# EAGLE design Attenuverting_LinExp_VCA-alt2 (EAGLE 7.5.0)

## Sheet 1 of 5: Top Board
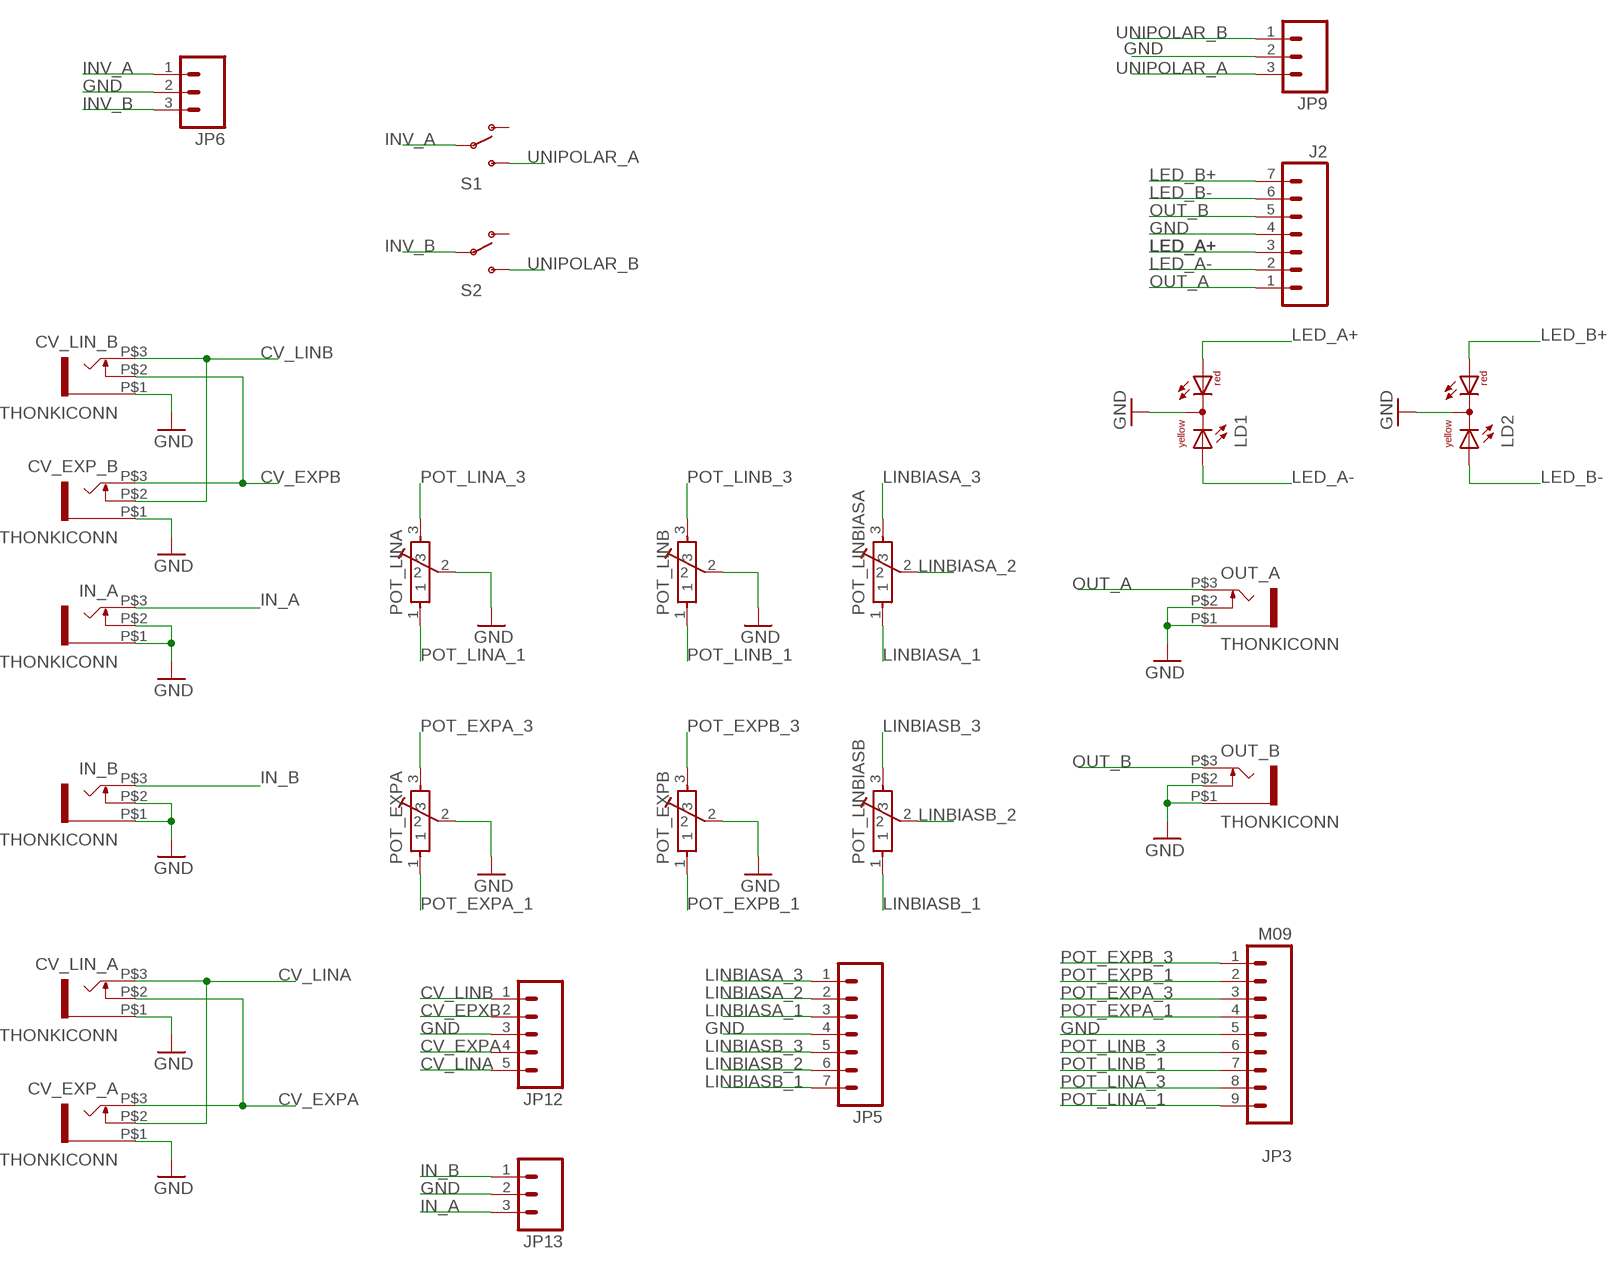
[diagram p0: schematic, sheet 1]

### Parts
CV_EXP_A  THONKICONN  [THONKICONN]
CV_EXP_B  THONKICONN  [THONKICONN]
CV_LIN_A  THONKICONN  [THONKICONN]
CV_LIN_B  THONKICONN  [THONKICONN]
IN_A  THONKICONN  [THONKICONN]
IN_B  THONKICONN  [THONKICONN]
J2  M07  [1X07]
JP3  M09  [1X09]
JP5  M07  [1X07]
JP6  M03PTH  [1X03]
JP9  M03PTH  [1X03]
JP12  M05PTH  [1X05]
JP13  M03PTH  [1X03]
LD1  DUOLED-RY-C  [DUOLED-C-5MM]
LD2  DUOLED-RY-C  [DUOLED-C-5MM]
OUT_A  THONKICONN  [THONKICONN]
OUT_B  THONKICONN  [THONKICONN]
POT_EXPA  POT-ALPS-RK09L1140  [POT-ALPS-RK09L1140]
POT_EXPB  POT-ALPS-RK09L1140  [POT-ALPS-RK09L1140]
POT_LINA  POT-ALPS-RK09L1140  [POT-ALPS-RK09L1140]
POT_LINB  POT-ALPS-RK09L1140  [POT-ALPS-RK09L1140]
POT_LINBIASA  POT-ALPS-RK09L1140  [POT-ALPS-RK09L1140]
POT_LINBIASB  POT-ALPS-RK09L1140  [POT-ALPS-RK09L1140]
S1  SWITCH-SPST  [SWITCH-SPDT-SALECOM-T8014]
S2  SWITCH-SPST  [SWITCH-SPDT-SALECOM-T8014]

### Nets
CV_EPXB: JP12.2
CV_EXPA: CV_EXP_A.P$3 CV_LIN_A.P$2 JP12.4 ; also sheet 3
CV_EXPB: CV_EXP_B.P$3 CV_LIN_B.P$2 ; also sheet 3
CV_LINA: CV_EXP_A.P$2 CV_LIN_A.P$3 JP12.5 ; also sheet 3
CV_LINB: CV_EXP_B.P$2 CV_LIN_B.P$3 JP12.1 ; also sheet 3
GND: CV_EXP_A.P$1 CV_EXP_B.P$1 CV_LIN_A.P$1 CV_LIN_B.P$1 IN_A.P$1 IN_A.P$2 IN_B.P$1 IN_B.P$2 J2.4 JP3.5 JP5.4 JP6.2 JP9.2 JP12.3 JP13.2 LD1.C LD2.C OUT_A.P$1 OUT_A.P$2 OUT_B.P$1 OUT_B.P$2 POT_EXPA.2 POT_EXPB.2 POT_LINA.2 POT_LINB.2 ; also sheet 2,3,4,5
IN_A: IN_A.P$3 JP13.3 ; also sheet 2
IN_B: IN_B.P$3 JP13.1 ; also sheet 2
INV_A: JP6.1 S1.2(P) ; also sheet 2
INV_B: JP6.3 S2.2(P) ; also sheet 2
LED_A+: J2.3 LD1.AR ; also sheet 2
LED_A-: J2.2 LD1.AX(AY) ; also sheet 2
LED_B+: J2.7 LD2.AR ; also sheet 2
LED_B-: J2.6 LD2.AX(AY) ; also sheet 2
LINBIASA_1: JP5.3 POT_LINBIASA.1 ; also sheet 3
LINBIASA_2: JP5.2 POT_LINBIASA.2 ; also sheet 3
LINBIASA_3: JP5.1 POT_LINBIASA.3 ; also sheet 3
LINBIASB_1: JP5.7 POT_LINBIASB.1 ; also sheet 3
LINBIASB_2: JP5.6 POT_LINBIASB.2 ; also sheet 3
LINBIASB_3: JP5.5 POT_LINBIASB.3 ; also sheet 3
OUT_A: J2.1 OUT_A.P$3 ; also sheet 2
OUT_B: J2.5 OUT_B.P$3 ; also sheet 2
POT_EXPA_1: JP3.4 POT_EXPA.1 ; also sheet 3
POT_EXPA_3: JP3.3 POT_EXPA.3 ; also sheet 3
POT_EXPB_1: JP3.2 POT_EXPB.1 ; also sheet 3
POT_EXPB_3: JP3.1 POT_EXPB.3 ; also sheet 3
POT_LINA_1: JP3.9 POT_LINA.1 ; also sheet 3
POT_LINA_3: JP3.8 POT_LINA.3 ; also sheet 3
POT_LINB_1: JP3.7 POT_LINB.1 ; also sheet 3
POT_LINB_3: JP3.6 POT_LINB.3 ; also sheet 3
UNIPOLAR_A: JP9.3 S1.3(S) ; also sheet 2
UNIPOLAR_B: JP9.1 S2.3(S) ; also sheet 2
Unconnected: POT_EXPA.P$5 POT_EXPA.P$6 POT_EXPB.P$5 POT_EXPB.P$6 POT_LINA.P$5 POT_LINA.P$6 POT_LINB.P$5 POT_LINB.P$6 POT_LINBIASA.P$5 POT_LINBIASA.P$6 POT_LINBIASB.P$5 POT_LINBIASB.P$6 S1.1(O) S2.1(O)

## Sheet 2 of 5: VCA Paths
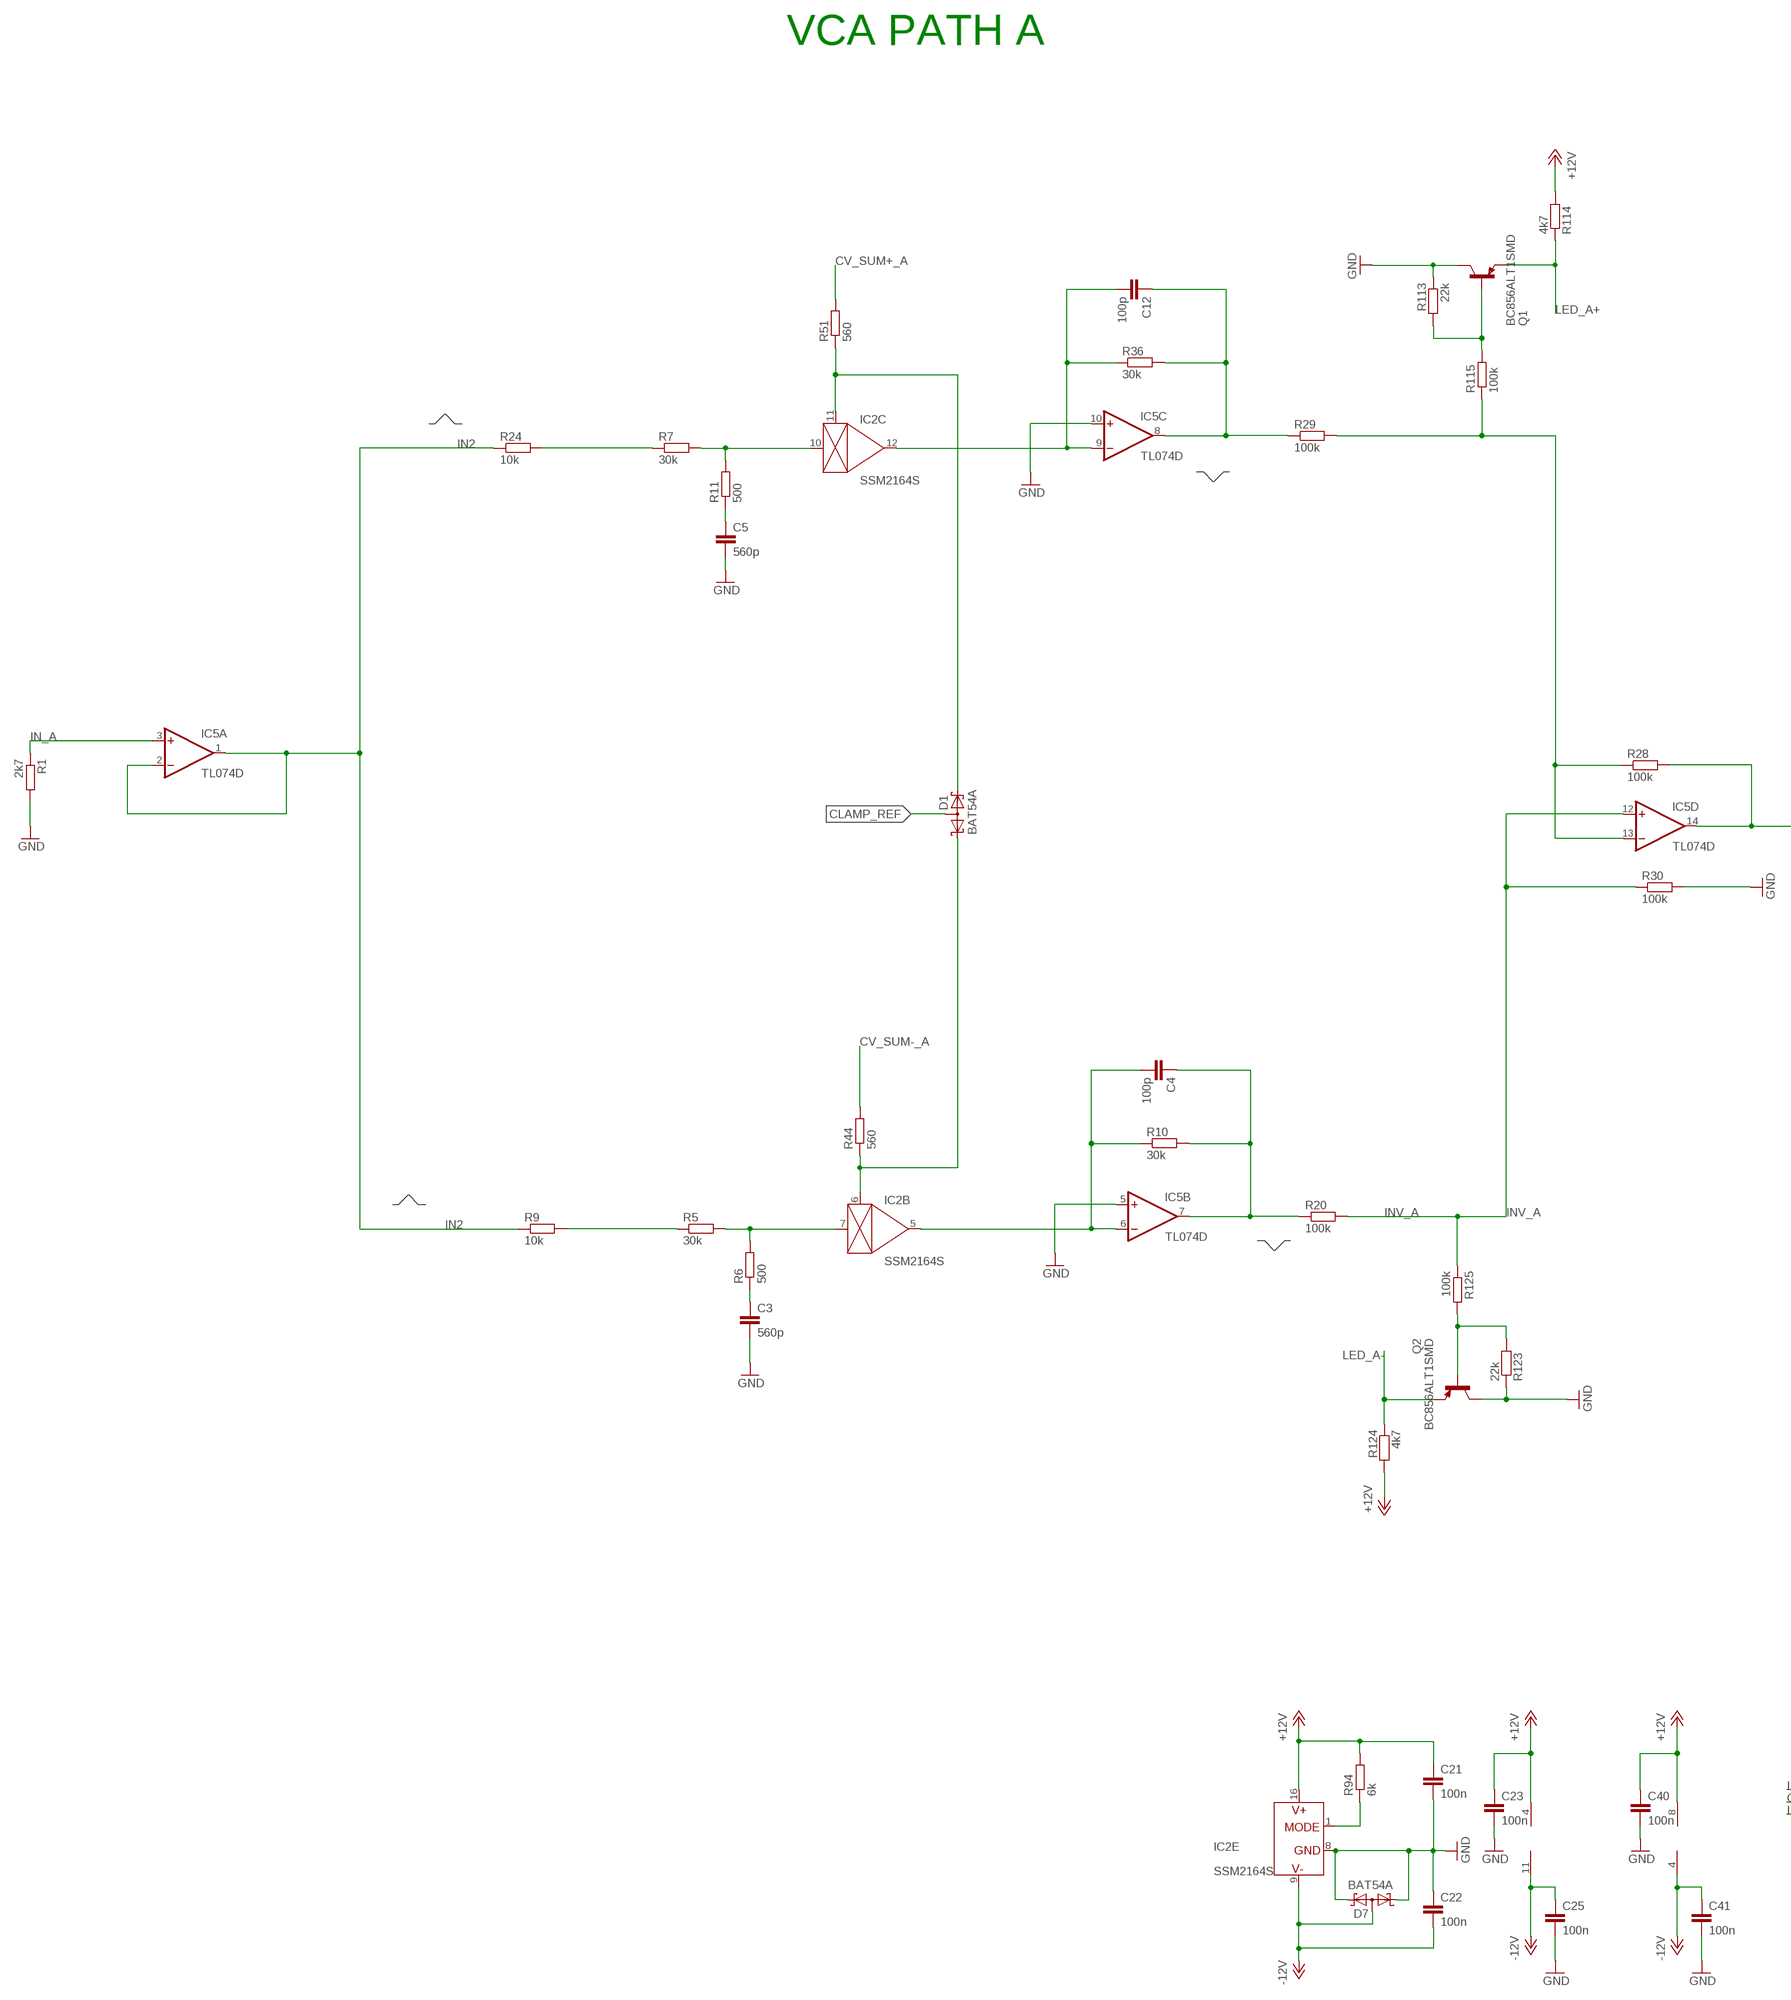
[diagram p1: schematic, sheet 2, part 1 of 2]
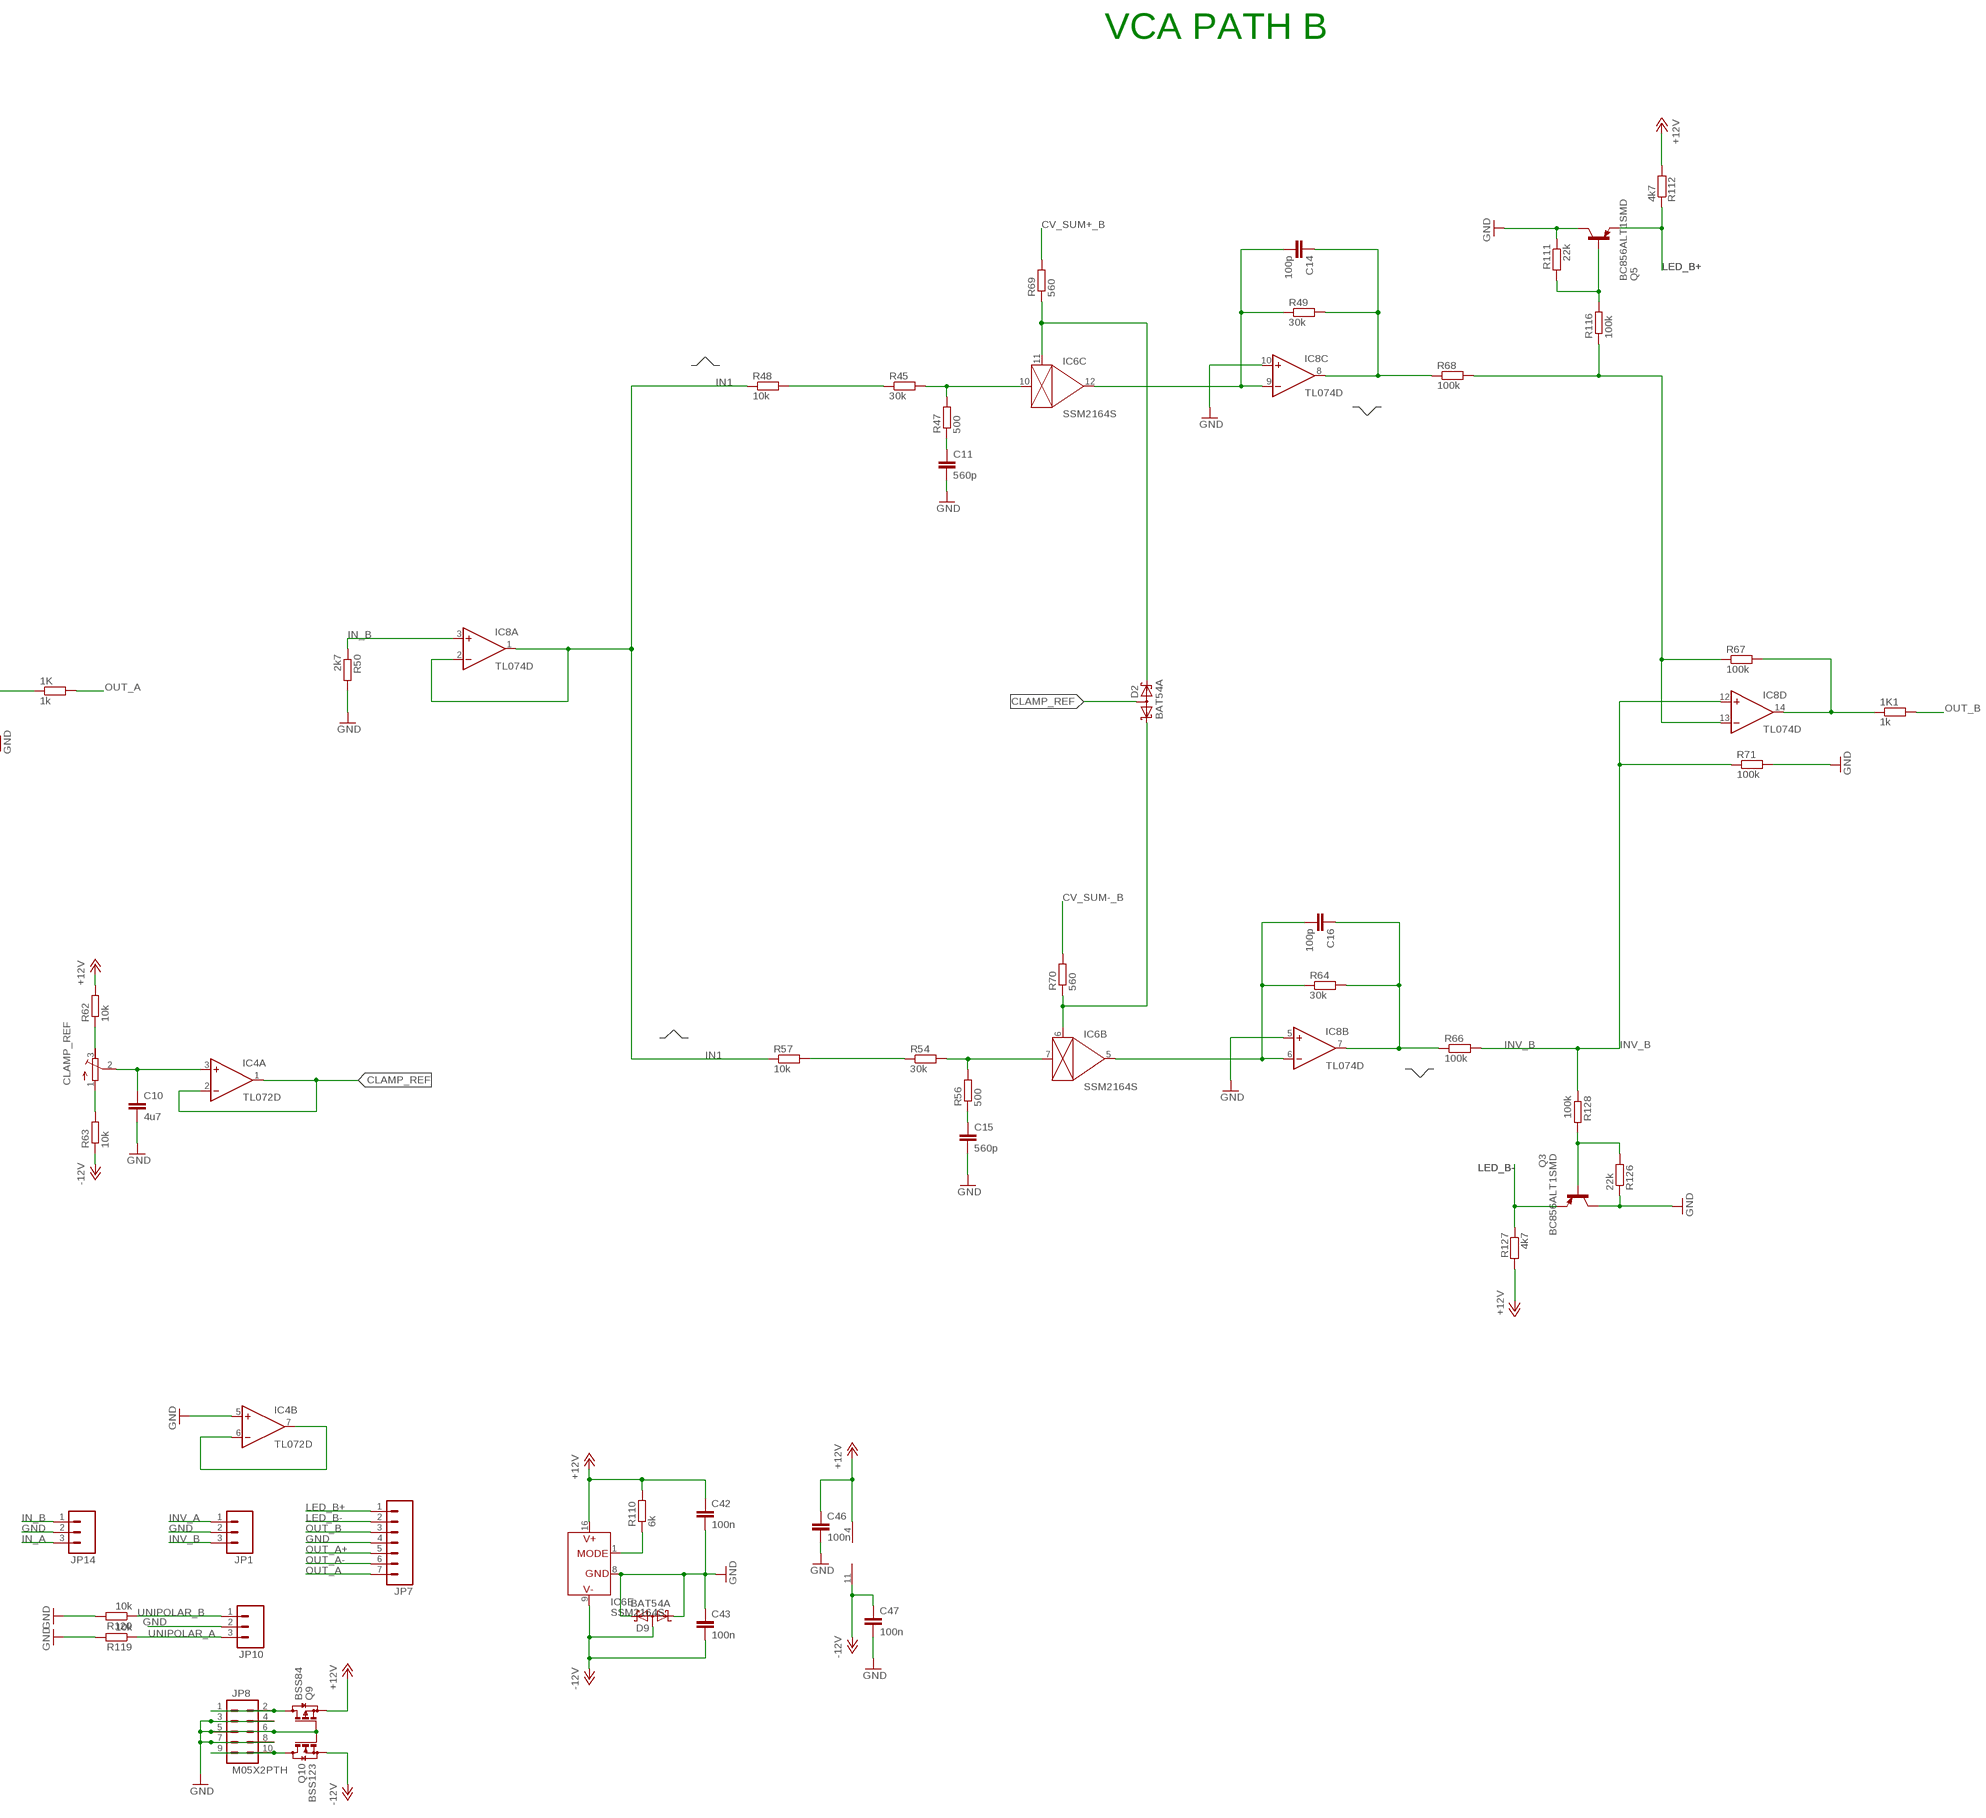
[diagram p2: schematic, sheet 2, part 2 of 2]

### Parts
1K  1k  R-EU_0603  [0603]
1K1  1k  R-EU_0603  [0603]
C3  560p  C-EUC0603K  [C0603K]
C4  100p  C-EUC0603K  [C0603K]
C5  560p  C-EUC0603K  [C0603K]
C10  4u7  C-EUC0603K  [C0603K]
C11  560p  C-EUC0603K  [C0603K]
C12  100p  C-EUC0603K  [C0603K]
C14  100p  C-EUC0603K  [C0603K]
C15  560p  C-EUC0603K  [C0603K]
C16  100p  C-EUC0603K  [C0603K]
C21  100n  C-EUC0603K  [C0603K]
C22  100n  C-EUC0603K  [C0603K]
C23  100n  C-EUC0603K  [C0603K]
C25  100n  C-EUC0603K  [C0603K]
C40  100n  C-EUC0603K  [C0603K]
C41  100n  C-EUC0603K  [C0603K]
C42  100n  C-EUC0603K  [C0603K]
C43  100n  C-EUC0603K  [C0603K]
C46  100n  C-EUC0603K  [C0603K]
C47  100n  C-EUC0603K  [C0603K]
CLAMP_REF  R-TRIMM64W  [RTRIM64W]
D1  BAT54A  [SOT23]
D2  BAT54A  [SOT23]
D7  BAT54A  [SOT23]
D9  BAT54A  [SOT23]
IC2  SSM2164S  [SOIC16N]
IC4  TL072D  [SO08]
IC5  TL074D  [SO14]
IC6  SSM2164S  [SOIC16N]
IC8  TL074D  [SO14]
JP1  M03PTH  [1X03]
JP7  M07  [1X07]
JP8  M05X2PTH  [AVR_ICSP]
JP10  M03PTH  [1X03]
JP14  M03PTH  [1X03]
Q1  BC856ALT1SMD  [SOT23-BEC]
Q2  BC856ALT1SMD  [SOT23-BEC]
Q3  BC856ALT1SMD  [SOT23-BEC]
Q5  BC856ALT1SMD  [SOT23-BEC]
Q9  BSS84  [SOT23]
Q10  BSS123  [SOT23]
R1  2k7  R-EU_0603  [0603]
R5  30k  R-EU_0603  [0603]
R6  500  R-EU_0603  [0603]
R7  30k  R-EU_0603  [0603]
R9  10k  R-EU_0603  [0603]
R10  30k  R-EU_0603  [0603]
R11  500  R-EU_0603  [0603]
R20  100k  R-EU_0603  [0603]
R24  10k  R-EU_0603  [0603]
R28  100k  R-EU_0603  [0603]
R29  100k  R-EU_0603  [0603]
R30  100k  R-EU_0603  [0603]
R36  30k  R-EU_0603  [0603]
R44  560  R-EU_0603  [0603]
R45  30k  R-EU_0603  [0603]
R47  500  R-EU_0603  [0603]
R48  10k  R-EU_0603  [0603]
R49  30k  R-EU_0603  [0603]
R50  2k7  R-EU_0603  [0603]
R51  560  R-EU_0603  [0603]
R54  30k  R-EU_0603  [0603]
R56  500  R-EU_0603  [0603]
R57  10k  R-EU_0603  [0603]
R62  10k  R-EU_0603  [0603]
R63  10k  R-EU_0603  [0603]
R64  30k  R-EU_0603  [0603]
R66  100k  R-EU_0603  [0603]
R67  100k  R-EU_0603  [0603]
R68  100k  R-EU_0603  [0603]
R69  560  R-EU_0603  [0603]
R70  560  R-EU_0603  [0603]
R71  100k  R-EU_0603  [0603]
R94  6k  R-EU_0603  [0603]
R110  6k  R-EU_0603  [0603]
R111  22k  R-EU_0603  [0603]
R112  4k7  R-EU_0603  [0603]
R113  22k  R-EU_0603  [0603]
R114  4k7  R-EU_0603  [0603]
R115  100k  R-EU_0603  [0603]
R116  100k  R-EU_0603  [0603]
R119  10k  R-EU_0603  [0603]
R120  10k  R-EU_0603  [0603]
R123  22k  R-EU_0603  [0603]
R124  4k7  R-EU_0603  [0603]
R125  100k  R-EU_0603  [0603]
R126  22k  R-EU_0603  [0603]
R127  4k7  R-EU_0603  [0603]
R128  100k  R-EU_0603  [0603]

### Nets
+12V: C21.1 C23.1 C40.1 C42.1 C46.1 IC2.16(E:V+) IC4.8(P:V+) IC5.4(P:V+) IC6.16(E:V+) IC8.4(P:V+) Q9.2(S) R62.2 R94.2 R110.2 R112.2 R114.2 R124.2 R127.2 ; also sheet 3,4,5
-12V: C22.2 C25.1 C41.1 C43.2 C47.1 D7.3(AA) D9.3(AA) IC2.9(E:V-) IC4.4(P:V-) IC5.11(P:V-) IC6.9(E:V-) IC8.11(P:V-) Q10.2(S) R63.1 ; also sheet 3,4,5
CLAMP_REF: D1.3(AA) D2.3(AA) IC4.1(A:OUT) IC4.2(A:-IN)
CV_SUM+_A: R51.2 ; also sheet 5
CV_SUM+_B: R69.2 ; also sheet 5
CV_SUM-_A: R44.2 ; also sheet 5
CV_SUM-_B: R70.2 ; also sheet 5
GND: C3.2 C5.2 C10.2 C11.2 C15.2 C21.2 C22.1 C23.2 C25.2 C40.2 C41.2 C42.2 C43.1 C46.2 C47.2 D7.1(K1) D7.2(K2) D9.1(K1) D9.2(K2) IC2.8(E:GND) IC4.5(B:+IN) IC5.5(B:+IN) IC5.10(C:+IN) IC6.8(E:GND) IC8.5(B:+IN) IC8.10(C:+IN) JP1.2 JP7.4 JP8.3 JP8.4 JP8.5 JP8.6 JP8.7 JP8.8 JP10.2 JP14.2 Q1.C Q2.C Q3.C Q5.C Q9.1(G) Q10.1(G) R1.2 R30.2 R50.2 R71.2 R111.1 R113.1 R119.2 R120.2 R123.1 R126.1 ; also sheet 1,3,4,5
IC2B_1: D2.1(K1) IC6.6(B:CTRL) R70.1
IC2B_6: D1.1(K1) IC2.6(B:CTRL) R44.1
IC2C_1: D2.2(K2) IC6.11(C:CTRL) R69.1
IC2C_11: D1.2(K2) IC2.11(C:CTRL) R51.1
IN1: IC8.1(A:OUT) IC8.2(A:-IN) R48.1 R57.1
IN2: IC5.1(A:OUT) IC5.2(A:-IN) R9.1 R24.1
IN_A: IC5.3(A:+IN) JP14.3 R1.1 ; also sheet 1
IN_B: IC8.3(A:+IN) JP14.1 R50.1 ; also sheet 1
INV_A: IC5.12(D:+IN) JP1.1 R20.2 R30.1 R125.1 ; also sheet 1
INV_B: IC8.12(D:+IN) JP1.3 R66.2 R71.1 R128.1 ; also sheet 1
LED_A+: Q1.E R114.1 ; also sheet 1
LED_A-: Q2.E R124.1 ; also sheet 1
LED_B+: JP7.1 Q5.E R112.1 ; also sheet 1
LED_B-: JP7.2 Q3.E R127.1 ; also sheet 1
N$4: JP8.9 JP8.10 Q10.3(D)
N$6: C3.1 R6.1
N$7: JP8.1 JP8.2 Q9.3(D)
N$14: Q2.B R123.2 R125.2
N$15: IC5.13(D:-IN) R28.1 R29.2 R115.1
N$16: IC2.7(B:IN) R5.2 R6.2
N$18: R5.1 R9.2
N$19: C5.1 R11.1
N$20: C4.2 IC2.5(B:OUT) IC5.6(B:-IN) R10.1
N$21: C4.1 IC5.7(B:OUT) R10.2 R20.1
N$23: IC2.10(C:IN) R7.2 R11.2
N$24: 1K.1 IC5.14(D:OUT) R28.2
N$25: C11.1 R47.1
N$26: R7.1 R24.2
N$27: Q3.B R126.2 R128.2
N$33: IC6.10(C:IN) R45.2 R47.2
N$37: CLAMP_REF.3(E) R62.1
N$42: Q5.B R111.2 R116.2
N$43: R45.1 R48.2
N$44: C14.2 IC6.12(C:OUT) IC8.9(C:-IN) R49.1
N$46: C14.1 IC8.8(C:OUT) R49.2 R68.1
N$47: C15.1 R56.1
N$48: IC6.7(B:IN) R54.2 R56.2
N$49: C12.2 IC2.12(C:OUT) IC5.9(C:-IN) R36.1
N$50: R54.1 R57.2
N$51: C12.1 IC5.8(C:OUT) R29.1 R36.2
N$52: C16.2 IC6.5(B:OUT) IC8.6(B:-IN) R64.1
N$56: CLAMP_REF.1(A) R63.2
N$57: C10.1 CLAMP_REF.2(S) IC4.3(A:+IN)
N$59: C16.1 IC8.7(B:OUT) R64.2 R66.1
N$60: IC8.13(D:-IN) R67.1 R68.2 R116.1
N$61: 1K1.1 IC8.14(D:OUT) R67.2
N$83: IC2.1(E:MODE) R94.1
N$93: IC4.6(B:-IN) IC4.7(B:OUT)
N$95: Q1.B R113.2 R115.2
N$97: IC6.1(E:MODE) R110.1
OUT_A: 1K.2 JP7.7 ; also sheet 1
OUT_A+: JP7.5
OUT_A-: JP7.6
OUT_B: 1K1.2 JP7.3 ; also sheet 1
UNIPOLAR_A: JP10.3 R119.1 ; also sheet 1
UNIPOLAR_B: JP10.1 R120.1 ; also sheet 1

### Notes on the sheet
- VCA PATH A
- VCA PATH B

## Sheet 3 of 5: Control Inputs
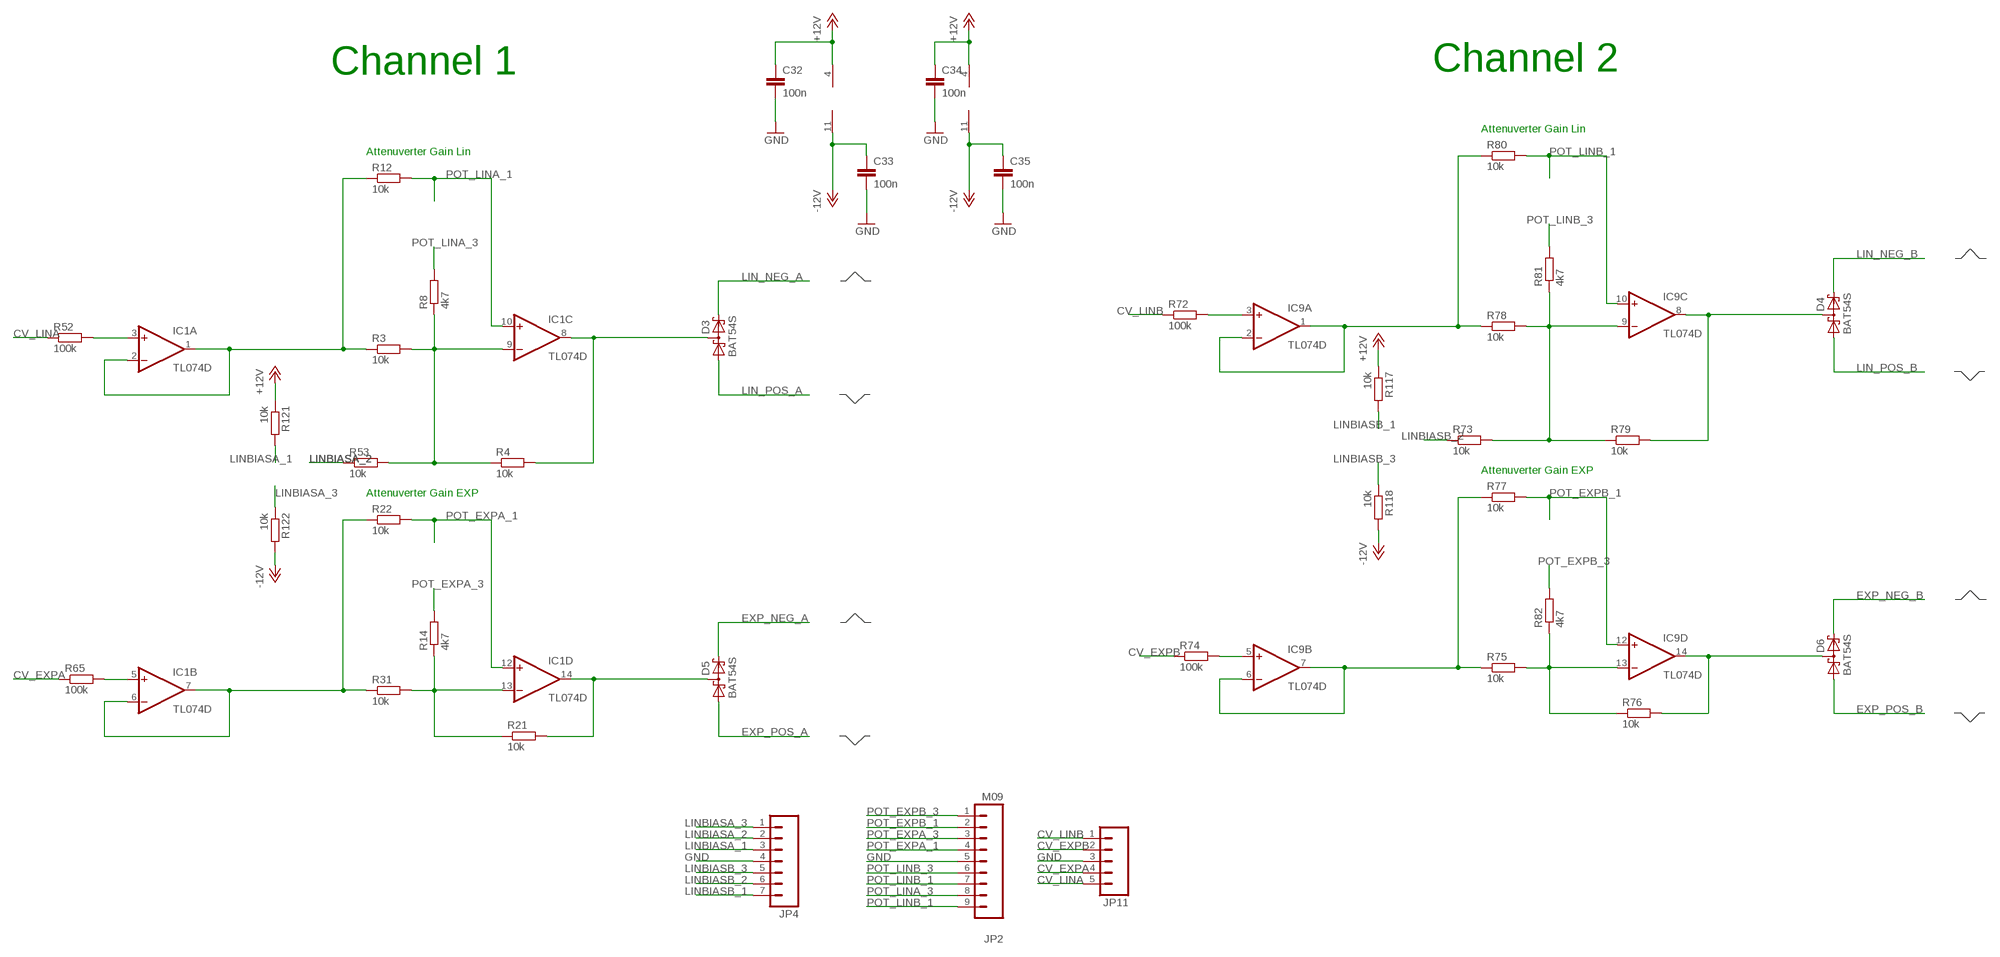
[diagram p3: schematic, sheet 3]

### Parts
C32  100n  C-EUC0603K  [C0603K]
C33  100n  C-EUC0603K  [C0603K]
C34  100n  C-EUC0603K  [C0603K]
C35  100n  C-EUC0603K  [C0603K]
D3  BAT54S  [SOT23]
D4  BAT54S  [SOT23]
D5  BAT54S  [SOT23]
D6  BAT54S  [SOT23]
IC1  TL074D  [SO14]
IC9  TL074D  [SO14]
JP2  M09  [1X09]
JP4  M07  [1X07]
JP11  M05PTH  [1X05]
R3  10k  R-EU_0603  [0603]
R4  10k  R-EU_0603  [0603]
R8  4k7  R-EU_0603  [0603]
R12  10k  R-EU_0603  [0603]
R14  4k7  R-EU_0603  [0603]
R21  10k  R-EU_0603  [0603]
R22  10k  R-EU_0603  [0603]
R31  10k  R-EU_0603  [0603]
R52  100k  R-EU_0603  [0603]
R53  10k  R-EU_0603  [0603]
R65  100k  R-EU_0603  [0603]
R72  100k  R-EU_0603  [0603]
R73  10k  R-EU_0603  [0603]
R74  100k  R-EU_0603  [0603]
R75  10k  R-EU_0603  [0603]
R76  10k  R-EU_0603  [0603]
R77  10k  R-EU_0603  [0603]
R78  10k  R-EU_0603  [0603]
R79  10k  R-EU_0603  [0603]
R80  10k  R-EU_0603  [0603]
R81  4k7  R-EU_0603  [0603]
R82  4k7  R-EU_0603  [0603]
R117  10k  R-EU_0603  [0603]
R118  10k  R-EU_0603  [0603]
R121  10k  R-EU_0603  [0603]
R122  10k  R-EU_0603  [0603]

### Nets
+12V: C32.1 C34.1 IC1.4(P:V+) IC9.4(P:V+) R117.1 R121.1 ; also sheet 2,4,5
-12V: C33.1 C35.1 IC1.11(P:V-) IC9.11(P:V-) R118.2 R122.2 ; also sheet 2,4,5
CV_1+: IC1.6(B:-IN) IC1.7(B:OUT) R22.1 R31.1
CV_1+1: IC9.6(B:-IN) IC9.7(B:OUT) R75.1 R77.1
CV_1-: IC1.1(A:OUT) IC1.2(A:-IN) R3.1 R12.1
CV_1-1: IC9.1(A:OUT) IC9.2(A:-IN) R78.1 R80.1
CV_EXPA: JP11.4 R65.1 ; also sheet 1
CV_EXPB: JP11.2 R74.1 ; also sheet 1
CV_LINA: JP11.5 R52.1 ; also sheet 1
CV_LINB: JP11.1 R72.1 ; also sheet 1
EXP_NEG_A: D5.2(C2) ; also sheet 5
EXP_NEG_B: D6.2(C2) ; also sheet 5
EXP_POS_A: D5.1(A1) ; also sheet 5
EXP_POS_B: D6.1(A1) ; also sheet 5
GND: C32.2 C33.2 C34.2 C35.2 JP2.5 JP4.4 JP11.3 ; also sheet 1,2,4,5
LIN_NEG_A: D3.2(C2) ; also sheet 4
LIN_NEG_B: D4.2(C2) ; also sheet 4
LIN_POS_A: D3.1(A1) ; also sheet 4
LIN_POS_B: D4.1(A1) ; also sheet 4
LINBIASA_1: JP4.3 R121.2 ; also sheet 1
LINBIASA_2: JP4.2 R53.1 ; also sheet 1
LINBIASA_3: JP4.1 R122.1 ; also sheet 1
LINBIASB_1: JP4.7 R117.2 ; also sheet 1
LINBIASB_2: JP4.6 R73.1 ; also sheet 1
LINBIASB_3: JP4.5 R118.1 ; also sheet 1
N$2: D3.3(C1A2) IC1.8(C:OUT) R4.2
N$5: IC1.3(A:+IN) R52.2
N$9: IC1.5(B:+IN) R65.2
N$12: IC1.13(D:-IN) R14.1 R21.1 R31.2
N$17: IC1.9(C:-IN) R3.2 R4.1 R8.1 R53.2
N$65: D6.3(C1A2) IC9.14(D:OUT) R76.2
N$66: IC9.13(D:-IN) R75.2 R76.1 R82.1
N$69: D4.3(C1A2) IC9.8(C:OUT) R79.2
N$72: IC9.3(A:+IN) R72.2
N$73: IC9.5(B:+IN) R74.2
N$74: IC9.9(C:-IN) R73.2 R78.2 R79.1 R81.1
N$94: D5.3(C1A2) IC1.14(D:OUT) R21.2
POT_EXPA_1: IC1.12(D:+IN) JP2.4 R22.2 ; also sheet 1
POT_EXPA_3: JP2.3 R14.2 ; also sheet 1
POT_EXPB_1: IC9.12(D:+IN) JP2.2 R77.2 ; also sheet 1
POT_EXPB_3: JP2.1 R82.2 ; also sheet 1
POT_LINA_1: IC1.10(C:+IN) R12.2 ; also sheet 1
POT_LINA_3: JP2.8 R8.2 ; also sheet 1
POT_LINB_1: IC9.10(C:+IN) JP2.7 JP2.9 R80.2 ; also sheet 1
POT_LINB_3: JP2.6 R81.2 ; also sheet 1

### Notes on the sheet
- Channel 2
- Channel 1
- Attenuverter Gain Lin
- Attenuverter Gain Lin
- Attenuverter Gain EXP
- Attenuverter Gain EXP

## Sheet 4 of 5: Linearsing CV
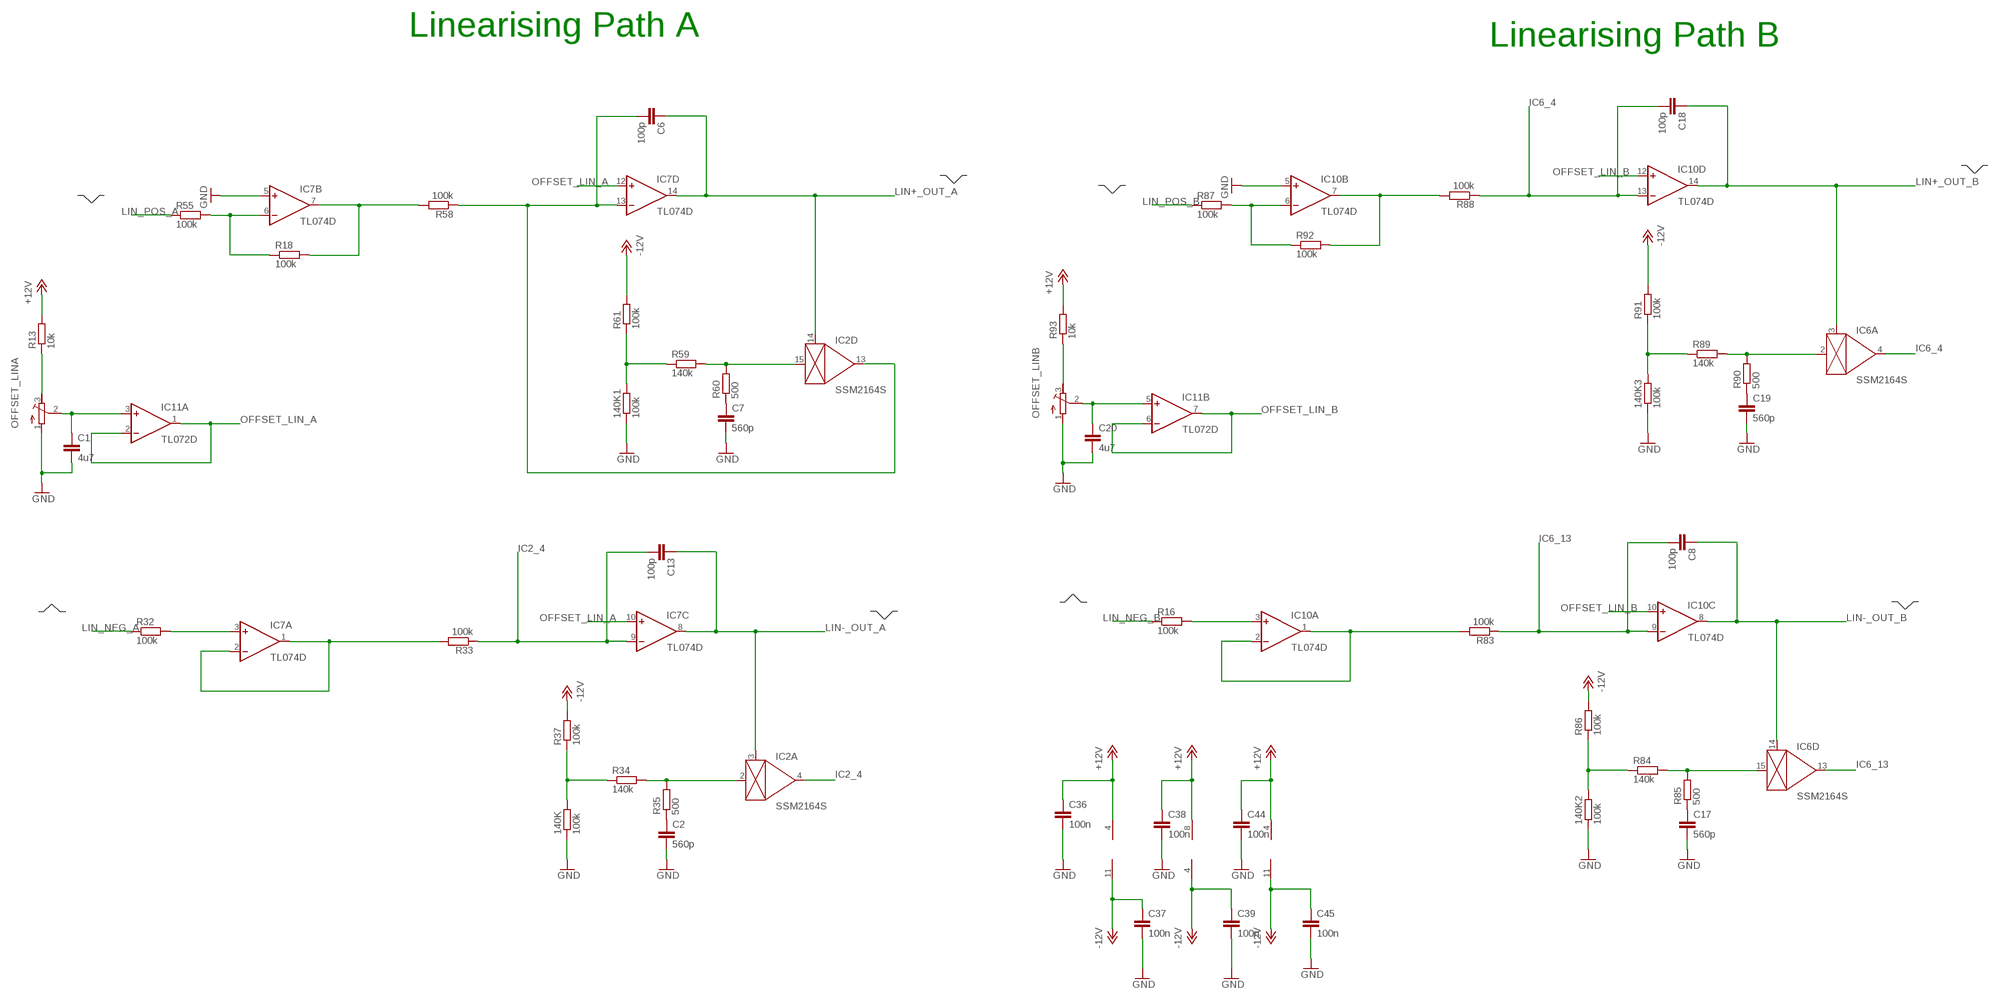
[diagram p4: schematic, sheet 4]

### Parts
140K  100k  R-EU_0603  [0603]
140K1  100k  R-EU_0603  [0603]
140K2  100k  R-EU_0603  [0603]
140K3  100k  R-EU_0603  [0603]
C1  4u7  C-EUC0603K  [C0603K]
C2  560p  C-EUC0603K  [C0603K]
C6  100p  C-EUC0603K  [C0603K]
C7  560p  C-EUC0603K  [C0603K]
C8  100p  C-EUC0603K  [C0603K]
C13  100p  C-EUC0603K  [C0603K]
C17  560p  C-EUC0603K  [C0603K]
C18  100p  C-EUC0603K  [C0603K]
C19  560p  C-EUC0603K  [C0603K]
C20  4u7  C-EUC0603K  [C0603K]
C36  100n  C-EUC0603K  [C0603K]
C37  100n  C-EUC0603K  [C0603K]
C38  100n  C-EUC0603K  [C0603K]
C39  100n  C-EUC0603K  [C0603K]
C44  100n  C-EUC0603K  [C0603K]
C45  100n  C-EUC0603K  [C0603K]
IC7  TL074D  [SO14]
IC10  TL074D  [SO14]
IC11  TL072D  [SO08]
OFFSET_LINA  R-TRIMM64W  [RTRIM64W]
OFFSET_LINB  R-TRIMM64W  [RTRIM64W]
R13  10k  R-EU_0603  [0603]
R16  100k  R-EU_0603  [0603]
R18  100k  R-EU_0603  [0603]
R32  100k  R-EU_0603  [0603]
R33  100k  R-EU_0603  [0603]
R34  140k  R-EU_0603  [0603]
R35  500  R-EU_0603  [0603]
R37  100k  R-EU_0603  [0603]
R55  100k  R-EU_0603  [0603]
R58  100k  R-EU_0603  [0603]
R59  140k  R-EU_0603  [0603]
R60  500  R-EU_0603  [0603]
R61  100k  R-EU_0603  [0603]
R83  100k  R-EU_0603  [0603]
R84  140k  R-EU_0603  [0603]
R85  500  R-EU_0603  [0603]
R86  100k  R-EU_0603  [0603]
R87  100k  R-EU_0603  [0603]
R88  100k  R-EU_0603  [0603]
R89  140k  R-EU_0603  [0603]
R90  500  R-EU_0603  [0603]
R91  100k  R-EU_0603  [0603]
R92  100k  R-EU_0603  [0603]
R93  10k  R-EU_0603  [0603]

### Nets
+12V: C36.1 C38.1 C44.1 IC7.4(P:V+) IC10.4(P:V+) IC11.8(P:V+) R13.2 R93.2 ; also sheet 2,3,5
-10V: 140K.2 R34.1 R37.1
-10V1: 140K1.2 R59.1 R61.1
-10V2: 140K3.2 R89.1 R91.1
-10V3: 140K2.2 R84.1 R86.1
-12V: C37.1 C39.1 C45.1 IC7.11(P:V-) IC10.11(P:V-) IC11.4(P:V-) R37.2 R61.2 R86.2 R91.2 ; also sheet 2,3,5
GND: 140K1.1 140K2.1 140K3.1 140K.1 C1.2 C2.2 C7.2 C17.2 C19.2 C20.2 C36.2 C37.2 C38.2 C39.2 C44.2 C45.2 IC7.5(B:+IN) IC10.5(B:+IN) OFFSET_LINA.1(A) OFFSET_LINB.1(A) ; also sheet 1,2,3,5
IC2_4: C13.2 IC2.4(A:OUT) IC7.9(C:-IN) R33.1
IC2_13: C6.2 IC2.13(D:OUT) IC7.13(D:-IN) R58.1
IC6_4: C18.2 IC6.4(A:OUT) IC10.13(D:-IN) R88.1
IC6_13: C8.2 IC6.13(D:OUT) IC10.9(C:-IN) R83.1
LIN+_OUT_A: C6.1 IC2.14(D:CTRL) IC7.14(D:OUT) ; also sheet 5
LIN+_OUT_B: C18.1 IC6.3(A:CTRL) IC10.14(D:OUT) ; also sheet 5
LIN-_OUT_A: C13.1 IC2.3(A:CTRL) IC7.8(C:OUT) ; also sheet 5
LIN-_OUT_B: C8.1 IC6.14(D:CTRL) IC10.8(C:OUT) ; also sheet 5
LIN_NEG_A: R32.1 ; also sheet 3
LIN_NEG_B: R16.1 ; also sheet 3
LIN_POS_A: R55.1 ; also sheet 3
LIN_POS_B: R87.1 ; also sheet 3
N$28: IC7.1(A:OUT) IC7.2(A:-IN) R33.2
N$29: C2.1 R35.1
N$30: IC2.2(A:IN) R34.2 R35.2
N$31: IC7.6(B:-IN) R18.1 R55.2
N$32: IC10.7(B:OUT) R88.2 R92.2
N$34: C19.1 R90.1
N$35: OFFSET_LINA.3(E) R13.1
N$38: C1.1 IC11.3(A:+IN) OFFSET_LINA.2(S)
N$39: IC7.3(A:+IN) R32.2
N$53: IC7.7(B:OUT) R18.2 R58.2
N$54: C7.1 R60.1
N$55: IC2.15(D:IN) R59.2 R60.2
N$58: IC6.2(A:IN) R89.2 R90.2
N$64: IC10.1(A:OUT) IC10.2(A:-IN) R83.2
N$77: IC10.3(A:+IN) R16.2
N$78: C17.1 R85.1
N$79: IC6.15(D:IN) R84.2 R85.2
N$80: IC10.6(B:-IN) R87.2 R92.1
N$81: OFFSET_LINB.3(E) R93.1
N$82: C20.1 IC11.5(B:+IN) OFFSET_LINB.2(S)
OFFSET_LIN_A: IC7.10(C:+IN) IC7.12(D:+IN) IC11.1(A:OUT) IC11.2(A:-IN)
OFFSET_LIN_B: IC10.10(C:+IN) IC10.12(D:+IN) IC11.6(B:-IN) IC11.7(B:OUT)

### Notes on the sheet
- Linearising Path A | Linearising Path B

## Sheet 5 of 5: CV Scale and Sum
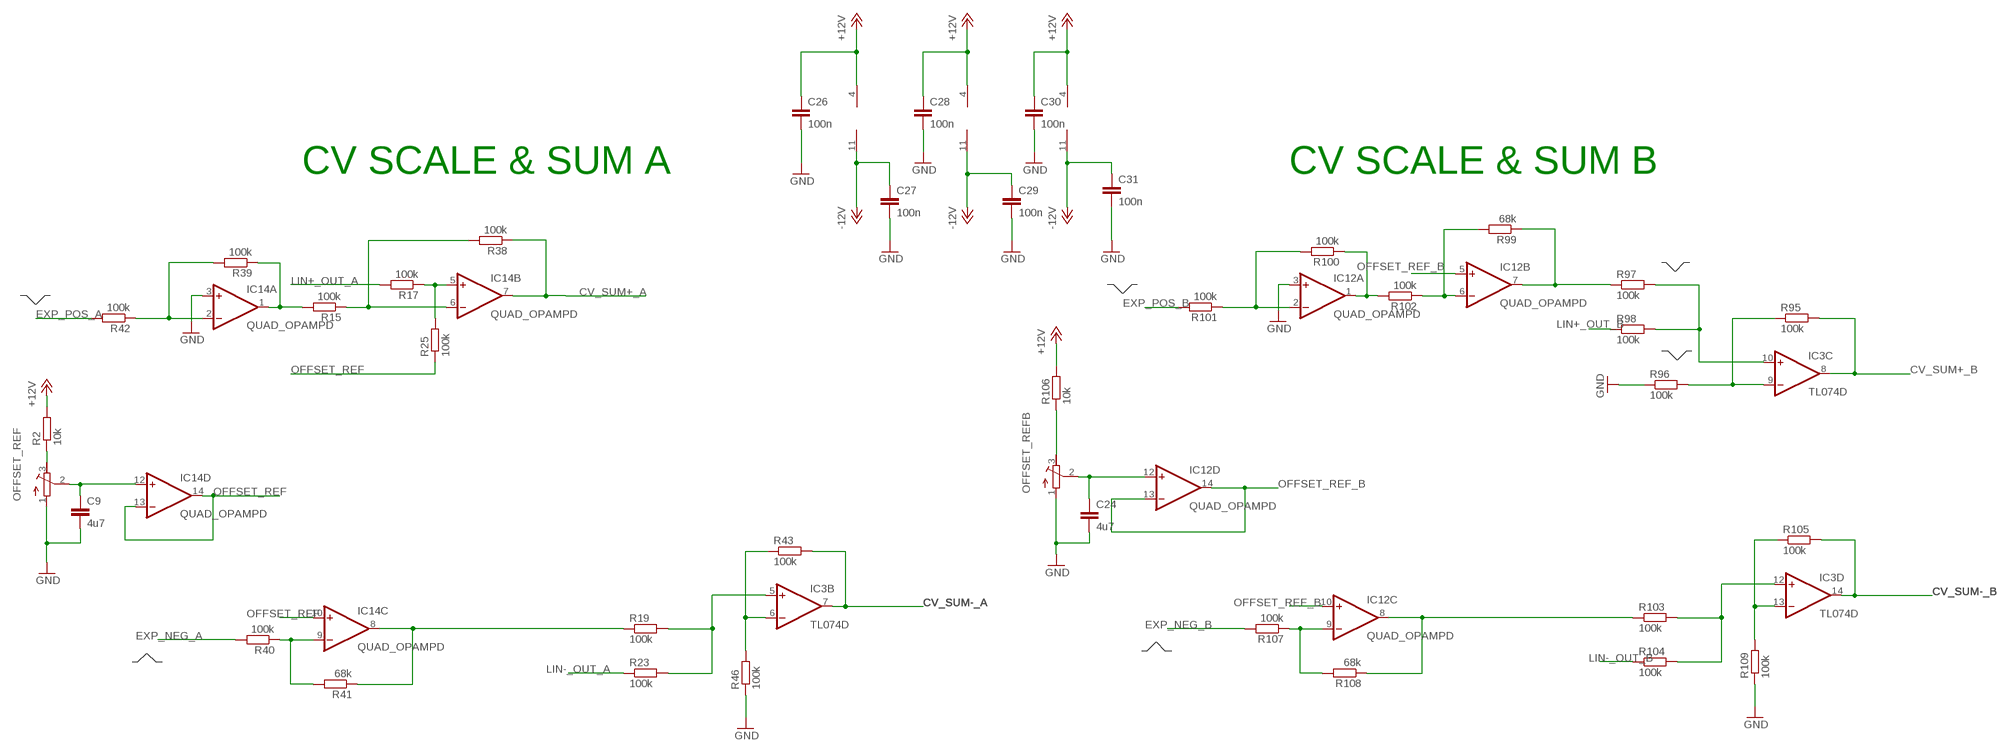
[diagram p5: schematic, sheet 5]

### Parts
C9  4u7  C-EUC0603K  [C0603K]
C24  4u7  C-EUC0603K  [C0603K]
C26  100n  C-EUC0603K  [C0603K]
C27  100n  C-EUC0603K  [C0603K]
C28  100n  C-EUC0603K  [C0603K]
C29  100n  C-EUC0603K  [C0603K]
C30  100n  C-EUC0603K  [C0603K]
C31  100n  C-EUC0603K  [C0603K]
IC3  TL074D  [SO14]
IC12  QUAD_OPAMPD  [SO14]
IC14  QUAD_OPAMPD  [SO14]
OFFSET_REF  R-TRIMM64W  [RTRIM64W]
OFFSET_REFB  R-TRIMM64W  [RTRIM64W]
R2  10k  R-EU_0603  [0603]
R15  100k  R-EU_0603  [0603]
R17  100k  R-EU_0603  [0603]
R19  100k  R-EU_0603  [0603]
R23  100k  R-EU_0603  [0603]
R25  100k  R-EU_0603  [0603]
R38  100k  R-EU_0603  [0603]
R39  100k  R-EU_0603  [0603]
R40  100k  R-EU_0603  [0603]
R41  68k  R-EU_0603  [0603]
R42  100k  R-EU_0603  [0603]
R43  100k  R-EU_0603  [0603]
R46  100k  R-EU_0603  [0603]
R95  100k  R-EU_0603  [0603]
R96  100k  R-EU_0603  [0603]
R97  100k  R-EU_0603  [0603]
R98  100k  R-EU_0603  [0603]
R99  68k  R-EU_0603  [0603]
R100  100k  R-EU_0603  [0603]
R101  100k  R-EU_0603  [0603]
R102  100k  R-EU_0603  [0603]
R103  100k  R-EU_0603  [0603]
R104  100k  R-EU_0603  [0603]
R105  100k  R-EU_0603  [0603]
R106  10k  R-EU_0603  [0603]
R107  100k  R-EU_0603  [0603]
R108  68k  R-EU_0603  [0603]
R109  100k  R-EU_0603  [0603]

### Nets
+12V: C26.1 C28.1 C30.1 IC3.4(P:V+) IC12.4(P:V+) IC14.4(P:V+) R2.2 R106.2 ; also sheet 2,3,4
-12V: C27.1 C29.1 C31.1 IC3.11(P:V-) IC12.11(P:V-) IC14.11(P:V-) ; also sheet 2,3,4
CV_SUM+_A: IC14.7(B:OUT) R38.1 ; also sheet 2
CV_SUM+_B: IC3.8(C:OUT) R95.2 ; also sheet 2
CV_SUM-_A: IC3.7(B:OUT) R43.2 ; also sheet 2
CV_SUM-_B: IC3.14(D:OUT) R105.2 ; also sheet 2
EXP_NEG: IC14.8(C:OUT) R19.1 R41.1
EXP_NEG1: IC12.8(C:OUT) R103.1 R108.1
EXP_NEG_A: R40.2 ; also sheet 3
EXP_NEG_B: R107.2 ; also sheet 3
EXP_POS_A: R42.2 ; also sheet 3
EXP_POS_B: R101.2 ; also sheet 3
GND: C9.2 C24.2 C26.2 C27.2 C28.2 C29.2 C30.2 C31.2 IC12.3(A:+IN) IC14.3(A:+IN) OFFSET_REF.1(A) OFFSET_REFB.1(A) R46.1 R96.1 R109.1 ; also sheet 1,2,3,4
IC2_1: IC12.7(B:OUT) R97.1 R99.1
IC2_2: IC12.6(B:-IN) R99.2 R102.1
IC2_8: IC14.6(B:-IN) R15.1 R38.2
LIN+_OUT_A: R17.2 ; also sheet 4
LIN+_OUT_B: R98.1 ; also sheet 4
LIN-_OUT_A: R23.1 ; also sheet 4
LIN-_OUT_B: R104.1 ; also sheet 4
N$1: IC3.5(B:+IN) R19.2 R23.2
N$3: IC3.6(B:-IN) R43.1 R46.2
N$10: IC14.5(B:+IN) R17.1 R25.2
N$11: IC14.1(A:OUT) R15.2 R39.1
N$22: IC14.2(A:-IN) R39.2 R42.1
N$36: OFFSET_REF.3(E) R2.1
N$40: C9.1 IC14.12(D:+IN) OFFSET_REF.2(S)
N$41: IC14.9(C:-IN) R40.1 R41.2
N$84: IC3.10(C:+IN) R97.2 R98.2
N$85: IC3.9(C:-IN) R95.1 R96.2
N$86: IC12.2(A:-IN) R100.2 R101.1
N$87: IC12.1(A:OUT) R100.1 R102.2
N$88: IC3.12(D:+IN) R103.2 R104.2
N$89: OFFSET_REFB.3(E) R106.1
N$90: C24.1 IC12.12(D:+IN) OFFSET_REFB.2(S)
N$91: IC12.9(C:-IN) R107.1 R108.2
N$92: IC3.13(D:-IN) R105.1 R109.2
OFFSET_REF: IC14.10(C:+IN) IC14.13(D:-IN) IC14.14(D:OUT) R25.1
OFFSET_REF_B: IC12.5(B:+IN) IC12.10(C:+IN) IC12.13(D:-IN) IC12.14(D:OUT)
Unconnected: IC3.1(A:OUT) IC3.2(A:-IN) IC3.3(A:+IN)

### Notes on the sheet
- CV SCALE & SUM A | CV SCALE & SUM B

## Library data of the parts
1K 1K1 = Rebel:R-EU_: RESISTOR, European symbol; MF: MULTICOMP; MPN: MC0063W06031160K; OC_FARNELL: 9330682
140K 140K1-140K3 R1-R14 R16-R25 R28-R37 R43-R98 R103-R106 R109 R110 R115-R122 R125 R128 = Rebel:R-EU_: RESISTOR, European symbol; OC_FARNELL: unknown
C1-C20 C24 = resistor:C-EU: CAPACITOR, European symbol; OC_FARNELL: unknown
C21-C23 C25-C35 C40-C43 C46 C47 = rcl:C-EU: CAPACITOR, European symbol
C36-C39 C44 C45 = rcl@1:C-EU: CAPACITOR, European symbol
CLAMP_REF OFFSET_LINA OFFSET_LINB OFFSET_REF OFFSET_REFB = resistor:R-TRIMM: Trimm resistor; OC_FARNELL: unknown
CV_EXP_A CV_EXP_B CV_LIN_A CV_LIN_B IN_A IN_B OUT_A OUT_B = Rebel:THONKICONN; OC_FARNELL: unknown
D1 D2 D7 D9 = diode:BAT54A: Schottky Diodes Source: Fairchild .. BAT54.pdf
D3-D6 = diode:BAT54S: Schottky Diodes Pin connection corrected 2011-05-04 Source: Fairchild .. BAT54.pdf; OC_FARNELL: unknown
IC1 IC5 IC7-IC10 = linear:TL074: OP AMP; OC_FARNELL: unknown
IC2 IC6 = ssm2164:SSM2164; OC_FARNELL: unknown
IC3 = linear:TL074: OP AMP
IC4 = linear:TL072: OP AMP
IC11 = linear:TL072: OP AMP; OC_FARNELL: unknown
IC12 IC14 = adafruit:QUAD_OPAMP: OP AMP Standard quad package
J2 JP4 JP5 JP7 = SparkFun:M07: Header 7 Standard 7-pin 0.1" header. Use with straight break away headers (SKU : PRT-00116), right angle break away headers (PRT-00553), swiss pins (PRT-00743), machine pins (PRT-00117), and female headers (PRT-00115). NOTES ON THE VARIANTS LOCK and LOCK_LONGPADS... This footprint was designed to help hold the alignment of a through-hole component (i.e. 7-pin header) while soldering it into place. You may notice that each hole has been shifted either up or down by 0.005 of an inch from it's more standard position (which is usually a perfectly straight line). This slight alteration caused the pins (the squares in the middle) to touch the edges of the holes. Because they are alternating, it causes a "brace" to hold the header in place. 0.005 has proven to be the perfect amount of "off-center" position when using our standard breakaway headers. Although looks a little odd when you look at the bare footprint, once you have a header in there, the alteration is very hard to notice. Also, if you push a header all the way into place, it is covered up entirely on the bottom side. This idea of altering the position of holes to aid alignment will be further integrated into the Sparkfun Library for other footprints. It can help hold any component with 3 or more connection pins.
JP1 JP6 JP9 JP10 JP13 JP14 = SparkFun:M03: Header 3 Standard 3-pin 0.1" header. Use with straight break away headers (SKU : PRT-00116), right angle break away headers (PRT-00553), swiss pins (PRT-00743), machine pins (PRT-00117), and female headers (PRT-00115). Molex polarized connector foot print use with SKU : PRT-08232 with associated crimp pins and housings.
JP2 JP3 = SparkFun:M09: Header 9 Standard 9-pin 0.1" header. Use with straight break away headers (SKU : PRT-00116), right angle break away headers (PRT-00553), swiss pins (PRT-00743), machine pins (PRT-00117), and female headers (PRT-00115).
JP8 = SparkFun:M05X2: Header 5x2 Standard 10-pin dual row 0.1" header. Commonly used with AVR-ISP. Use with Spark Fun Electronics SKU: PRT-00778
JP11 JP12 = SparkFun:M05: Header 5 Standard 5-pin 0.1" header. Use with straight break away headers (SKU : PRT-00116), right angle break away headers (PRT-00553), swiss pins (PRT-00743), machine pins (PRT-00117), and female headers (PRT-00115). Molex polarized connector foot print use with SKU : PRT-08230 with associated crimp pins and housings.
LD1 LD2 = led:DUOLED-RY-C: DUO LED 2 colors (red/yellow), 5 mm, round, common Cathode www.ligitek.com or other producers.
POT_EXPA POT_EXPB POT_LINA POT_LINB POT_LINBIASA POT_LINBIASB = Rebel:POT-ALPS-RK09L
Q1-Q3 Q5 = transistor-pnp:BC856*: PNP Transistror
Q9 = transistor-small-signal:BSS84: P-CHANNEL MOS FET; OC_FARNELL: 1779264
Q10 = transistor-small-signal:BSS123: N-CHANNEL MOS FET; OC_FARNELL: 1843725
R15 R38-R42 R99-R102 R107 R108 R111-R114 R123 R124 R126 R127 = Rebel:R-EU_: RESISTOR, European symbol
S1 S2 = Rebel:SWITCH-SPST: SPST Switch Simple slide switch. Spark Fun Electronics SKU : COM-00102

## Board
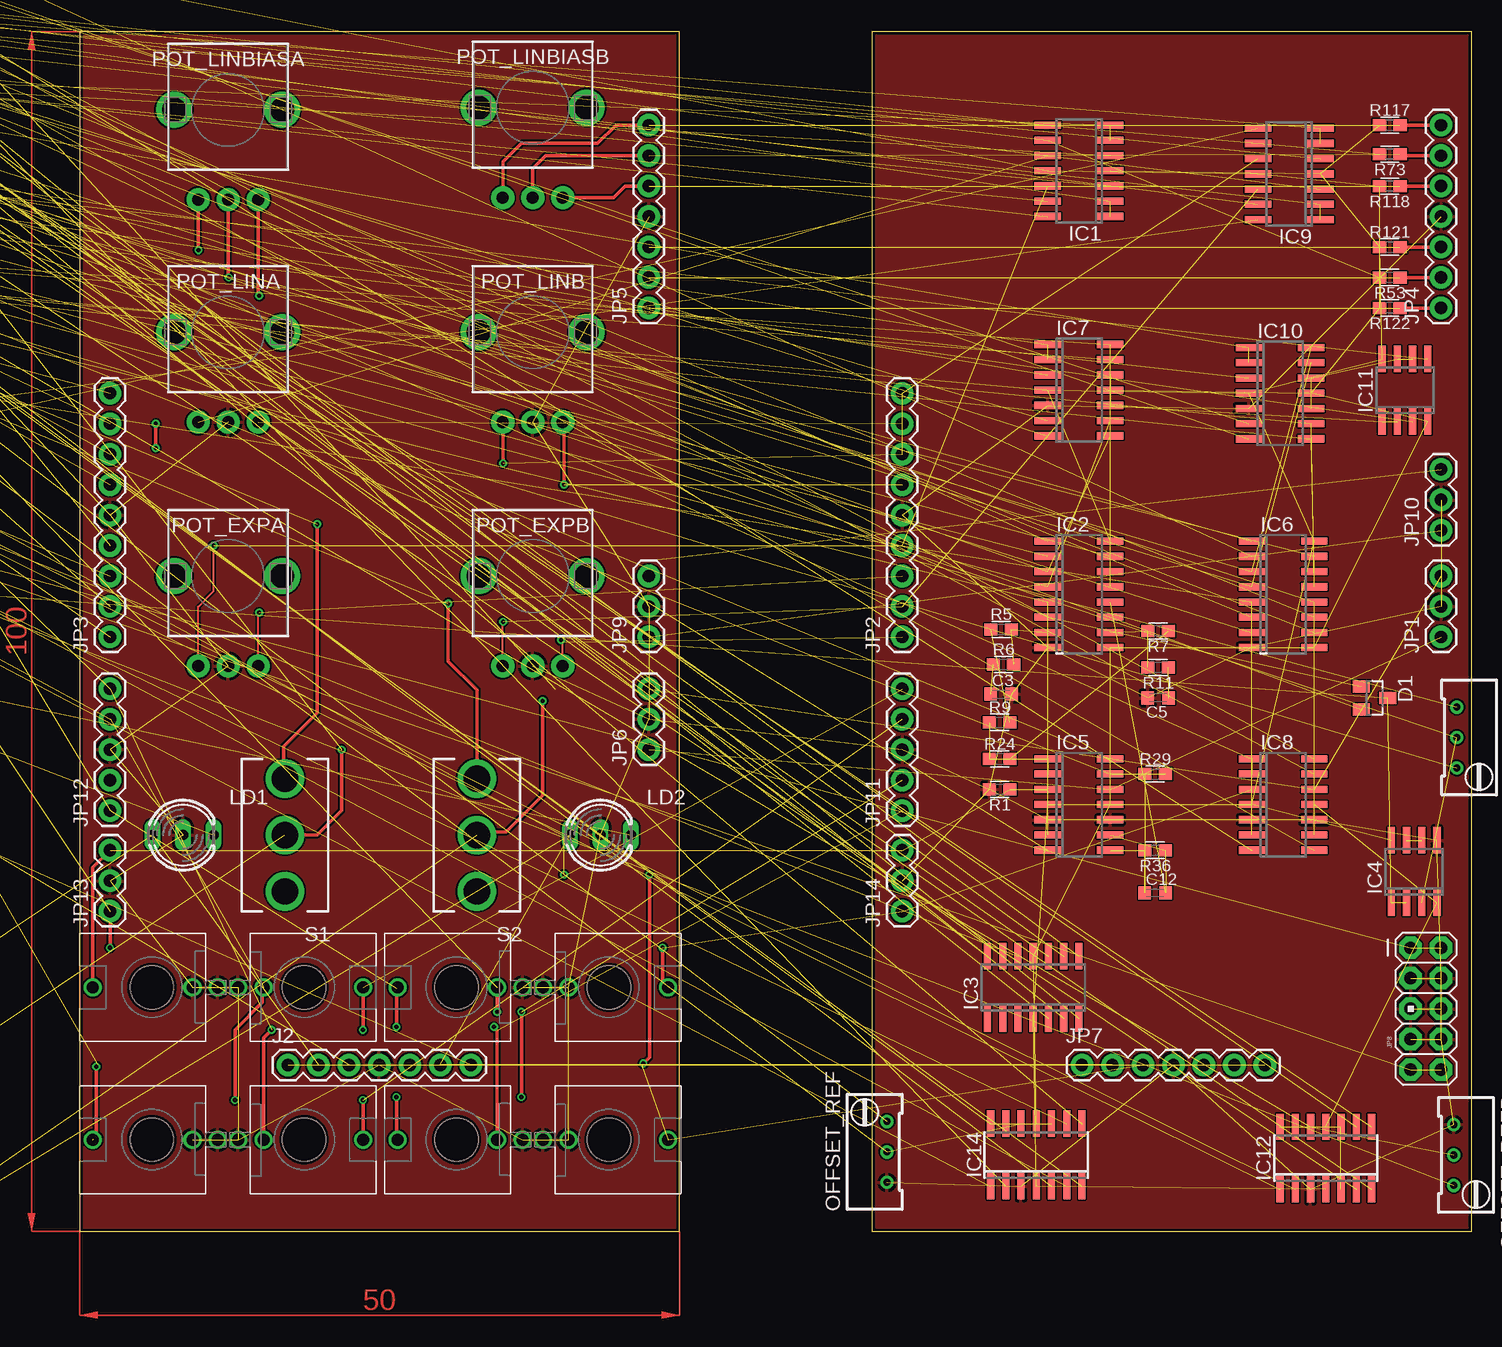
[diagram p6: board, top side]
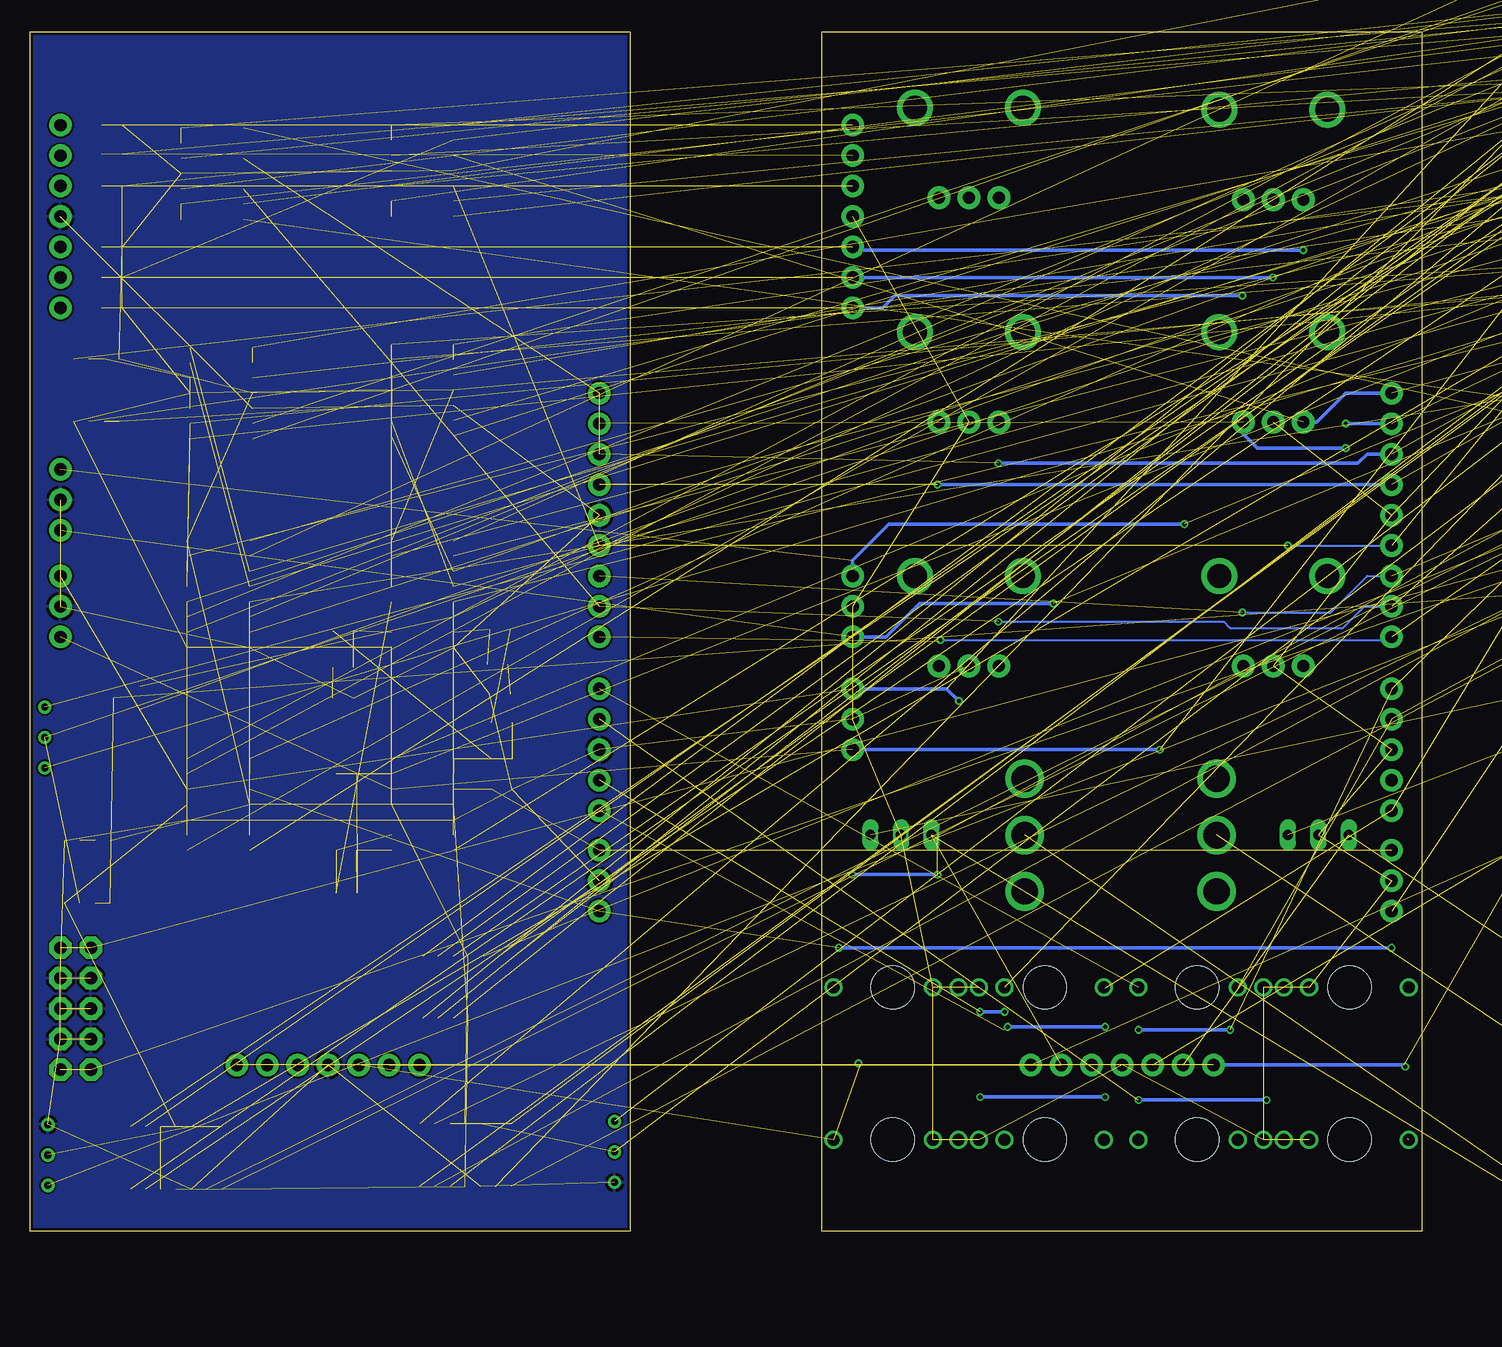
[diagram p7: board, bottom side, seen from below]

Size 116.04 x 100 mm. Coordinates in mm from the lower left corner, seen from the top.
Outline: 0,0 50,0 50,100 0,100 0,0
Outline: 66.04,0 116.04,0 116.04,100 66.04,100 66.04,0
Copper layers (1*16): Top 0.035mm / dielectric 1.5mm / Bottom 0.035mm
Design rules "SeeedStudio_2layer_DRU_no_angle_20140221": minimum track width 6mil, minimum drill 12mil, track to track 6mil, track to pad 6mil, pad to pad 6mil, via to via 6mil, smd to smd 0mil, copper to edge 10mil, drill to drill 10mil, minimum pad ring 10mil, minimum via ring 6mil, stop-mask expansion 2mil, vias tented up to drill 100mil, thermal gap 10mil

### Footprints (pad centres in the part's own frame; a part is rotated, then mirrored left to right if it is on the bottom)
0603 = smd 1.1 x 1: 1 -0.85,0; 2 0.85,0
C0603K = smd 1.05 x 1.08: 1 -0.875,0; 2 0.875,0
RTRIM64W = drill 0.61: 1 1.27,-2.54; 2 1.27,0; 3 1.27,2.54
THONKICONN = drill 1: P$1 0,-5.5; P$2 0,-3.38; P$3 0,4.92 | hole 3.6: 0,0
SOT23 = smd 1 x 1.4: 1 -0.95,-1.1; 2 0.95,-1.1; 3 0,1.1
SO14 = smd 0.6 x 2.2: 1 -3.81,-2.6; 2 -2.54,-2.6; 3 -1.27,-2.6; 4 0,-2.6; 5 1.27,-2.6; 6 2.54,-2.6; 7 3.81,-2.6; 8 3.81,2.6; 9 2.54,2.6; 10 1.27,2.6; 11 0,2.6; 12 -1.27,2.6; 13 -2.54,2.6; 14 -3.81,2.6
SOIC16N = smd 0.6 x 2.2: 1 -4.445,-2.6; 2 -3.175,-2.6; 3 -1.905,-2.6; 4 -0.635,-2.6; 5 0.635,-2.6; 6 1.905,-2.6; 7 3.175,-2.6; 8 4.445,-2.6; 9 4.445,2.6; 10 3.175,2.6; 11 1.905,2.6; 12 0.635,2.6; 13 -0.635,2.6; 14 -1.905,2.6; 15 -3.175,2.6; 16 -4.445,2.6
SO08 = smd 0.6 x 2.2: 1 -1.905,-2.6; 2 -0.635,-2.6; 3 0.635,-2.6; 4 1.905,-2.6; 5 1.905,2.6; 6 0.635,2.6; 7 -0.635,2.6; 8 -1.905,2.6
1X07 = drill 1.016 pad 1.88: 1 0,0; 2 2.54,0; 3 5.08,0; 4 7.62,0; 5 10.16,0; 6 12.7,0; 7 15.24,0
1X03 = drill 1.016 pad 1.88: 1 0,0; 2 2.54,0; 3 5.08,0
1X09 = drill 1.016 pad 1.88: 1 0,0; 2 2.54,0; 3 5.08,0; 4 7.62,0; 5 10.16,0; 6 12.7,0; 7 15.24,0; 8 17.78,0; 9 20.32,0
AVR_ICSP = drill 1.016 pad 1.88 octagon: 1 -1.27,5.08; 2 1.27,5.08; 3 -1.27,2.54; 4 1.27,2.54; 5 -1.27,0; 6 1.27,0; 7 -1.27,-2.54; 8 1.27,-2.54; 9 -1.27,-5.08; 10 1.27,-5.08
1X05 = drill 1.016 pad 1.88: 1 0,0; 2 2.54,0; 3 5.08,0; 4 7.62,0; 5 10.16,0
DUOLED-C-5MM = drill 0.813 long: AR 2.54,0; AX -2.54,0; C 0,0
POT-ALPS-RK09L1140 = drill 1 pad 1.93: 1 -2.5,-7.5; 2 0,-7.5; 3 2.5,-7.5 | drill 2: P$5 -4.5,0; P$6 4.5,0
SOT23-BEC = smd 1 x 1.4: B -0.95,-1.1; C 0,1.1; E 0.95,-1.1
SWITCH-SPDT-SALECOM-T8014 = drill 2.2: 1 0,4.699; 2 0,0; 3 0,-4.699

### Placement (x,y rotation side)
1K  -53.34,107.95 0 top  (outside the outline)
1K1  -71.12,92.71 0 top  (outside the outline)
140K  -63.5,87.63 0 top  (outside the outline)
140K1  -45.72,87.63 0 top  (outside the outline)
140K2  -52.07,87.63 0 top  (outside the outline)
140K3  -58.42,87.63 0 top  (outside the outline)
C1  -36.83,88.9 0 top  (outside the outline)
C2  -36.83,83.82 0 top  (outside the outline)
C3  76.83,44.77 0 top
C4  -46.99,83.82 0 top  (outside the outline)
C5  89.92,44.45 180 top
C6  -57.15,83.82 0 top  (outside the outline)
C7  -62.23,83.82 0 top  (outside the outline)
C8  -67.31,83.82 0 top  (outside the outline)
C9  -40.64,88.9 0 top  (outside the outline)
C10  -25.4,88.9 0 top  (outside the outline)
C11  -72.39,83.82 0 top  (outside the outline)
C12  89.66,28.19 0 top
C13  -82.55,83.82 0 top  (outside the outline)
C14  -87.63,83.82 0 top  (outside the outline)
C15  -92.71,83.82 0 top  (outside the outline)
C16  -97.79,83.82 0 top  (outside the outline)
C17  -102.87,83.82 0 top  (outside the outline)
C18  -16.51,88.9 0 top  (outside the outline)
C19  -21.59,88.9 0 top  (outside the outline)
C20  -29.21,88.9 0 top  (outside the outline)
C21  -86.36,71.12 0 top  (outside the outline)
C22  -91.44,71.12 0 top  (outside the outline)
C23  -96.52,71.12 0 top  (outside the outline)
C24  -33.02,88.9 0 top  (outside the outline)
C25  -101.6,71.12 0 top  (outside the outline)
C26  -16.51,78.74 0 top  (outside the outline)
C27  -21.59,78.74 0 top  (outside the outline)
C28  -26.67,78.74 0 top  (outside the outline)
C29  -31.75,78.74 0 top  (outside the outline)
C30  -36.83,78.74 0 top  (outside the outline)
C31  -41.91,78.74 0 top  (outside the outline)
C32  -46.99,78.74 0 top  (outside the outline)
C33  -52.07,78.74 0 top  (outside the outline)
C34  -57.15,78.74 0 top  (outside the outline)
C35  -62.23,78.74 0 top  (outside the outline)
C36  -67.31,78.74 0 top  (outside the outline)
C37  -72.39,78.74 0 top  (outside the outline)
C38  -77.47,78.74 0 top  (outside the outline)
C39  -82.55,78.74 0 top  (outside the outline)
C40  -87.63,78.74 0 top  (outside the outline)
C41  -92.71,78.74 0 top  (outside the outline)
C42  -97.79,78.74 0 top  (outside the outline)
C43  -102.87,78.74 0 top  (outside the outline)
C44  -16.51,83.82 0 top  (outside the outline)
C45  -21.59,83.82 0 top  (outside the outline)
C46  -26.67,83.82 0 top  (outside the outline)
C47  -31.75,83.82 0 top  (outside the outline)
CLAMP_REF  116.08,41.15 180 top
CV_EXP_A  18.73,7.62 270 top
CV_EXP_B  31.43,7.62 90 top
CV_LIN_A  18.73,20.32 270 top
CV_LIN_B  31.43,20.32 90 top
D1  107.95,44.45 270 top
D2  -78.74,57.15 0 top  (outside the outline)
D3  -101.6,57.15 0 top  (outside the outline)
D4  -17.78,64.77 0 top  (outside the outline)
D5  -25.4,64.77 0 top  (outside the outline)
D6  -33.02,64.77 0 top  (outside the outline)
D7  -86.36,57.15 0 top  (outside the outline)
D9  -93.98,57.15 0 top  (outside the outline)
IC1  83.31,88.39 90 top
IC2  83.31,53.09 270 top
IC3  79.5,20.32 0 top
IC4  111.25,29.97 0 top
IC5  83.31,35.56 270 top
IC6  100.33,53.09 270 top
IC7  83.31,70.1 270 top
IC8  100.33,35.56 270 top
IC9  100.84,88.14 90 top
IC10  100.08,69.85 270 top
IC11  110.49,70.1 0 top
IC12  103.89,6.1 0 top
IC14  79.76,6.35 0 top
IN_A  6.03,20.32 90 top
IN_B  44.13,20.32 270 top
J2  17.37,13.84 0 top
JP1  113.5,49.53 90 top
JP2  68.58,49.53 90 top
JP3  2.54,49.53 90 top
JP4  113.5,76.96 90 top
JP5  47.46,76.96 90 top
JP6  47.46,40.13 90 top
JP7  83.57,13.84 0 top
JP8  112.23,18.54 0 top
JP9  47.46,49.53 90 top
JP10  113.5,58.42 90 top
JP11  68.58,35.05 90 top
JP12  2.54,35.05 90 top
JP13  2.54,26.67 90 top
JP14  68.58,26.67 90 top
LD1  8.64,33.02 0 top
LD2  43.43,33.02 0 top
OFFSET_LINA  -45.72,38.1 0 top  (outside the outline)
OFFSET_LINB  -53.34,38.1 0 top  (outside the outline)
OFFSET_REF  66.04,6.6 0 top
OFFSET_REFB  115.82,6.35 180 top
OUT_A  6.03,7.62 90 top
OUT_B  44.13,7.62 270 top
POT_EXPA  12.38,54.61 0 top
POT_EXPB  37.78,54.61 0 top
POT_LINA  12.38,74.93 0 top
POT_LINB  37.78,74.93 0 top
POT_LINBIASA  12.38,93.47 0 top
POT_LINBIASB  37.78,93.66 0 top
Q1  -49.53,57.15 0 top  (outside the outline)
Q2  -104.39,-39.37 0 top  (outside the outline)
Q3  -104.39,-53.34 0 top  (outside the outline)
Q5  -63.5,57.15 0 top  (outside the outline)
Q9  -46.99,64.77 0 top  (outside the outline)
Q10  -40.64,64.77 0 top  (outside the outline)
R1  76.71,36.83 180 top
R2  -60.96,107.95 0 top  (outside the outline)
R3  -64.77,107.95 0 top  (outside the outline)
R4  -68.58,107.95 0 top  (outside the outline)
R5  76.83,50.16 0 top
R6  77.03,47.24 0 top
R7  89.92,50.04 180 top
R8  -83.82,107.95 0 top  (outside the outline)
R9  76.71,42.42 0 top
R10  -74.93,92.71 0 top  (outside the outline)
R11  89.92,46.99 180 top
R12  -82.55,92.71 0 top  (outside the outline)
R13  -86.36,92.71 0 top  (outside the outline)
R14  -90.17,92.71 0 top  (outside the outline)
R15  -93.98,92.71 0 top  (outside the outline)
R16  -97.79,92.71 0 top  (outside the outline)
R17  -101.6,92.71 0 top  (outside the outline)
R18  -15.24,96.52 0 top  (outside the outline)
R19  -19.05,96.52 0 top  (outside the outline)
R20  -22.86,96.52 0 top  (outside the outline)
R21  -26.67,96.52 0 top  (outside the outline)
R22  -30.48,96.52 0 top  (outside the outline)
R23  -34.29,96.52 0 top  (outside the outline)
R24  76.71,39.37 0 top
R25  -41.91,96.52 0 top  (outside the outline)
R28  -53.34,96.52 0 top  (outside the outline)
R29  89.66,38.1 0 top
R30  -60.96,96.52 0 top  (outside the outline)
R31  -64.77,96.52 0 top  (outside the outline)
R32  -68.58,96.52 0 top  (outside the outline)
R33  -72.39,96.52 0 top  (outside the outline)
R34  -76.2,96.52 0 top  (outside the outline)
R35  -80.01,96.52 0 top  (outside the outline)
R36  89.66,31.75 180 top
R37  -87.63,96.52 0 top  (outside the outline)
R38  -91.44,96.52 0 top  (outside the outline)
R39  -95.25,96.52 0 top  (outside the outline)
R40  -99.06,96.52 0 top  (outside the outline)
R41  -102.87,96.52 0 top  (outside the outline)
R42  -15.24,100.33 0 top  (outside the outline)
R43  -19.05,100.33 0 top  (outside the outline)
R44  -22.86,100.33 0 top  (outside the outline)
R45  -26.67,100.33 0 top  (outside the outline)
R46  -30.48,100.33 0 top  (outside the outline)
R47  -34.29,100.33 0 top  (outside the outline)
R48  -38.1,100.33 0 top  (outside the outline)
R49  -41.91,100.33 0 top  (outside the outline)
R50  -45.72,100.33 0 top  (outside the outline)
R51  -49.53,100.33 0 top  (outside the outline)
R52  -53.34,100.33 0 top  (outside the outline)
R53  109.22,79.5 180 top
R54  -60.96,100.33 0 top  (outside the outline)
R55  -64.77,100.33 0 top  (outside the outline)
R56  -68.58,100.33 0 top  (outside the outline)
R57  -72.39,100.33 0 top  (outside the outline)
R58  -76.2,100.33 0 top  (outside the outline)
R59  -80.01,100.33 0 top  (outside the outline)
R60  -83.82,100.33 0 top  (outside the outline)
R61  -87.63,100.33 0 top  (outside the outline)
R62  -91.44,100.33 0 top  (outside the outline)
R63  -95.25,100.33 0 top  (outside the outline)
R64  -99.06,100.33 0 top  (outside the outline)
R65  -102.87,100.33 0 top  (outside the outline)
R66  -15.24,104.14 0 top  (outside the outline)
R67  -19.05,104.14 0 top  (outside the outline)
R68  -22.86,104.14 0 top  (outside the outline)
R69  -26.67,104.14 0 top  (outside the outline)
R70  -30.48,104.14 0 top  (outside the outline)
R71  -34.29,104.14 0 top  (outside the outline)
R72  -38.1,104.14 0 top  (outside the outline)
R73  109.22,89.79 180 top
R74  -45.72,104.14 0 top  (outside the outline)
R75  -49.53,104.14 0 top  (outside the outline)
R76  -53.34,104.14 0 top  (outside the outline)
R77  -57.15,104.14 0 top  (outside the outline)
R78  -60.96,104.14 0 top  (outside the outline)
R79  -64.77,104.14 0 top  (outside the outline)
R80  -68.58,104.14 0 top  (outside the outline)
R81  -72.39,104.14 0 top  (outside the outline)
R82  -76.2,104.14 0 top  (outside the outline)
R83  -80.01,104.14 0 top  (outside the outline)
R84  -83.82,104.14 0 top  (outside the outline)
R85  -87.63,104.14 0 top  (outside the outline)
R86  -91.44,104.14 0 top  (outside the outline)
R87  -95.25,104.14 0 top  (outside the outline)
R88  -99.06,104.14 0 top  (outside the outline)
R89  -102.87,104.14 0 top  (outside the outline)
R90  -15.24,107.95 0 top  (outside the outline)
R91  -19.05,107.95 0 top  (outside the outline)
R92  -22.86,107.95 0 top  (outside the outline)
R93  -26.67,107.95 0 top  (outside the outline)
R94  -30.48,107.95 0 top  (outside the outline)
R95  -34.29,107.95 0 top  (outside the outline)
R96  -38.1,107.95 0 top  (outside the outline)
R97  -41.91,107.95 0 top  (outside the outline)
R98  -45.72,107.95 0 top  (outside the outline)
R99  -49.53,107.95 0 top  (outside the outline)
R100  -68.58,87.63 0 top  (outside the outline)
R101  -73.66,87.63 0 top  (outside the outline)
R102  -78.74,87.63 0 top  (outside the outline)
R103  -83.82,87.63 0 top  (outside the outline)
R104  -88.9,87.63 0 top  (outside the outline)
R105  -93.98,87.63 0 top  (outside the outline)
R106  -99.06,87.63 0 top  (outside the outline)
R107  -104.14,87.63 0 top  (outside the outline)
R108  -15.24,92.71 0 top  (outside the outline)
R109  -20.32,92.71 0 top  (outside the outline)
R110  -25.4,92.71 0 top  (outside the outline)
R111  -30.48,92.71 0 top  (outside the outline)
R112  -35.56,92.71 0 top  (outside the outline)
R113  -40.64,92.71 0 top  (outside the outline)
R114  -45.72,92.71 0 top  (outside the outline)
R115  -50.8,92.71 0 top  (outside the outline)
R116  -55.88,92.71 0 top  (outside the outline)
R117  109.22,92.2 0 top
R118  109.22,87.12 180 top
R119  -60.96,92.71 0 top  (outside the outline)
R120  -66.04,92.71 0 top  (outside the outline)
R121  109.22,82.04 0 top
R122  109.22,76.96 180 top
R123  -104.14,-45.21 0 top  (outside the outline)
R124  -98.55,-45.21 0 top  (outside the outline)
R125  -104.14,-48.51 0 top  (outside the outline)
R126  -104.14,-59.18 0 top  (outside the outline)
R127  -98.55,-59.18 0 top  (outside the outline)
R128  -104.14,-62.48 0 top  (outside the outline)
S1  17.12,33.02 180 top
S2  33.12,33.02 180 top

### Tracks (layer width: path | path; a pad name or v marks a point on that pad's centre or on a via)
+12V  (39 unrouted)
-10V  (2 unrouted)
-10V1  (2 unrouted)
-10V2  (2 unrouted)
-10V3  (2 unrouted)
-12V  (35 unrouted)
CLAMP_REF  (3 unrouted)
CV_1+  (3 unrouted)
CV_1+1  (3 unrouted)
CV_1-  (3 unrouted)
CV_1-1  (3 unrouted)
CV_EXPA  (via drill 0.35)  (3 unrouted)
  Top 0.305: CV_EXP_A.P$3 23.65,10.89 v23.62,10.92 | v12.95,10.92 12.95,16.76 15.24,19.05 15.24,20.21 CV_LIN_A.P$2
  Bottom 0.305: v23.62,10.92 v12.95,10.92
CV_EXPB  (via drill 0.35)  (2 unrouted)
  Top 0.305: CV_LIN_B.P$2 34.81,18.3 v34.8,18.29 | v36.83,18.29 v36.83,11.18 | v26.42,11.18 26.42,7.72 CV_EXP_B.P$3
  Bottom 0.305: v34.8,18.29 v36.83,18.29 | v36.83,11.18 v26.42,11.18
CV_LINA  (via drill 0.35)  (3 unrouted)
  Top 0.305: CV_EXP_A.P$2 15.35,16.11 v16,16.76 | v23.62,16.76 23.62,20.29 CV_LIN_A.P$3
  Bottom 0.305: v16,16.76 v23.62,16.76
CV_LINB  (via drill 0.35)  (3 unrouted)
  Top 0.305: CV_EXP_B.P$2 34.81,16.75 v34.54,17.02 | v26.42,17.02 26.42,20.22 CV_LIN_B.P$3
  Bottom 0.305: v34.54,17.02 v26.42,17.02
CV_SUM+_A  (2 unrouted)
CV_SUM+_B  (2 unrouted)
CV_SUM-_A  (2 unrouted)
CV_SUM-_B  (2 unrouted)
EXP_NEG  (2 unrouted)
EXP_NEG1  (2 unrouted)
EXP_NEG_A  (1 unrouted)
EXP_NEG_B  (1 unrouted)
EXP_POS_A  (1 unrouted)
EXP_POS_B  (1 unrouted)
GND  (118 unrouted)
  pour Top: -0.76,101.85 51.31,101.85 51.31,-1.52 -3.05,-1.52 -3.05,101.85
  pour Bottom: 63.5,101.85 118.36,101.85 118.36,-2.03 62.48,-2.03 62.48,101.85
  pour Top: 65.53,101.35 117.35,101.35 117.35,-1.02 64.01,-1.02 64.01,101.35
IC2_1  (2 unrouted)
IC2_2  (2 unrouted)
IC2_4  (3 unrouted)
IC2_8  (2 unrouted)
IC2_13  (3 unrouted)
IC2B_1  (2 unrouted)
IC2B_6  (2 unrouted)
IC2C_1  (2 unrouted)
IC2C_11  (2 unrouted)
IC6_4  (3 unrouted)
IC6_13  (3 unrouted)
IN1  (3 unrouted)
IN2  (3 unrouted)
IN_A  (3 unrouted)
  Top 0.305: IN_A.P$3 1.11,30.32 JP13.3
IN_B  (via drill 0.35)  (3 unrouted)
  Top 0.305: JP13.1 v2.54,23.62 | v48.61,23.62 48.61,20.77 IN_B.P$3
  Bottom 0.305: v2.54,23.62 v48.61,23.62
INV_A  (via drill 0.35)  (5 unrouted)
  Top 0.305: v21.84,40.13 21.84,35.05 19.81,33.02 S1.2
  Bottom 0.305: JP6.1 v21.84,40.13
INV_B  (via drill 0.35)  (5 unrouted)
  Top 0.305: v38.61,44.2 38.61,36.32 35.56,33.27 33.38,33.27 S2.2
  Bottom 0.305: JP6.3 39.62,45.21 v38.61,44.2
LED_A+  (3 unrouted)
LED_A-  (3 unrouted)
LED_B+  (4 unrouted)
LED_B-  (4 unrouted)
LIN+_OUT_A  (3 unrouted)
LIN+_OUT_B  (3 unrouted)
LIN-_OUT_A  (3 unrouted)
LIN-_OUT_B  (3 unrouted)
LIN_NEG_A  (1 unrouted)
LIN_NEG_B  (1 unrouted)
LIN_POS_A  (1 unrouted)
LIN_POS_B  (1 unrouted)
LINBIASA_1  (via drill 0.35)  (1 unrouted)
  Top 0.305: POT_LINBIASA.1 9.88,81.81 v9.91,81.79 | R121.2 JP4.3
  Bottom 0.305: v9.91,81.79 47.21,81.79 JP5.3
LINBIASA_2  (via drill 0.35)  (1 unrouted)
  Top 0.305: POT_LINBIASA.2 12.38,79.57 v12.45,79.5 | R53.1 JP4.2
  Bottom 0.305: v12.45,79.5 JP5.2
LINBIASA_3  (via drill 0.35)  (1 unrouted)
  Top 0.305: POT_LINBIASA.3 14.88,78.08 v14.99,77.98 | R122.1 JP4.1
  Bottom 0.305: v14.99,77.98 43.94,77.98 44.96,76.96 JP5.1
LINBIASB_1  (1 unrouted)
  Top 0.305: JP5.7 44.7,92.2 43.18,90.68 36.83,90.68 35.31,89.15 35.31,86.19 POT_LINBIASB.1 | R117.2 JP4.7
LINBIASB_2  (1 unrouted)
  Top 0.305: POT_LINBIASB.2 37.78,88.58 38.86,89.66 JP5.6 | JP4.6 110.2,89.66 R73.1
LINBIASB_3  (1 unrouted)
  Top 0.305: POT_LINBIASB.3 44.51,86.16 45.47,87.12 JP5.5 | R118.1 JP4.5
N$1  (2 unrouted)
N$2  (2 unrouted)
N$3  (2 unrouted)
N$4  (2 unrouted)
N$5  (1 unrouted)
N$6  (1 unrouted)
N$7  (2 unrouted)
N$9  (1 unrouted)
N$10  (2 unrouted)
N$11  (2 unrouted)
N$12  (3 unrouted)
N$14  (2 unrouted)
N$15  (3 unrouted)
N$16  (2 unrouted)
N$17  (4 unrouted)
N$18  (1 unrouted)
N$19  (1 unrouted)
N$20  (3 unrouted)
N$21  (3 unrouted)
N$22  (2 unrouted)
N$23  (2 unrouted)
N$24  (2 unrouted)
N$25  (1 unrouted)
N$26  (1 unrouted)
N$27  (2 unrouted)
N$28  (2 unrouted)
N$29  (1 unrouted)
N$30  (2 unrouted)
N$31  (2 unrouted)
N$32  (2 unrouted)
N$33  (2 unrouted)
N$34  (1 unrouted)
N$35  (1 unrouted)
N$36  (1 unrouted)
N$37  (1 unrouted)
N$38  (2 unrouted)
N$39  (1 unrouted)
N$40  (2 unrouted)
N$41  (2 unrouted)
N$42  (2 unrouted)
N$43  (1 unrouted)
N$44  (3 unrouted)
N$46  (3 unrouted)
N$47  (1 unrouted)
N$48  (2 unrouted)
N$49  (3 unrouted)
N$50  (1 unrouted)
N$51  (3 unrouted)
N$52  (3 unrouted)
N$53  (2 unrouted)
N$54  (1 unrouted)
N$55  (2 unrouted)
N$56  (1 unrouted)
N$57  (2 unrouted)
N$58  (2 unrouted)
N$59  (3 unrouted)
N$60  (3 unrouted)
N$61  (2 unrouted)
N$64  (2 unrouted)
N$65  (2 unrouted)
N$66  (3 unrouted)
N$69  (2 unrouted)
N$72  (1 unrouted)
N$73  (1 unrouted)
N$74  (4 unrouted)
N$77  (1 unrouted)
N$78  (1 unrouted)
N$79  (2 unrouted)
N$80  (2 unrouted)
N$81  (1 unrouted)
N$82  (2 unrouted)
N$83  (1 unrouted)
N$84  (2 unrouted)
N$85  (2 unrouted)
N$86  (2 unrouted)
N$87  (2 unrouted)
N$88  (2 unrouted)
N$89  (1 unrouted)
N$90  (2 unrouted)
N$91  (2 unrouted)
N$92  (2 unrouted)
N$93  (1 unrouted)
N$94  (2 unrouted)
N$95  (2 unrouted)
N$97  (1 unrouted)
OFFSET_LIN_A  (3 unrouted)
OFFSET_LIN_B  (3 unrouted)
OFFSET_REF  (3 unrouted)
OFFSET_REF_B  (3 unrouted)
OUT_A  (via drill 0.35)  (3 unrouted)
  Top 0.305: v1.39,13.72 1.39,7.9 1.17,7.68
  Bottom 0.305: J2.1 1.52,13.84 v1.39,13.72
OUT_B  (via drill 0.35)  (5 unrouted)
  Top 0.305: v46.99,13.97 47.5,14.48 v47.5,29.72
  Bottom 0.305: 46.86,13.84 v46.99,13.97 | v47.5,29.72 v40.39,29.72
POT_EXPA_1  (via drill 0.35)  (3 unrouted)
  Top 0.152: POT_EXPA.1 9.88,52.05 11.18,53.34 v11.18,57.15
  Bottom 0.152: v11.18,57.15 JP3.4
POT_EXPA_3  (via drill 0.35)  (2 unrouted)
  Top 0.152: POT_EXPA.3 14.88,51.46 v14.99,51.56
  Bottom 0.152: v14.99,51.56 7.62,51.56 4.57,54.61 JP3.3
POT_EXPB_1  (via drill 0.35)  (3 unrouted)
  Top 0.152: POT_EXPB.1 35.28,50.78 v35.31,50.8
  Bottom 0.152: v35.31,50.8 16.51,50.8 16,50.29 6.6,50.29 4.83,52.07 JP3.2
POT_EXPB_3  (via drill 0.35)  (2 unrouted)
  Top 0.152: POT_EXPB.3 40.28,49.13 v40.13,49.28
  Bottom 0.152: v40.13,49.28 2.79,49.28 JP3.1
POT_LINA_1  (2 unrouted)
  Bottom 0.305: POT_LINA.1 8.77,67.43 6.35,69.85 JP3.9
POT_LINA_3  (via drill 0.35)  (2 unrouted)
  Top 0.305: v6.35,67.31 v6.35,65.28
  Bottom 0.305: JP3.8 v6.35,67.31 | POT_LINA.3 14.88,66.44 13.72,65.28 v6.35,65.28
POT_LINB_1  (via drill 0.35)  (4 unrouted)
  Top 0.305: v35.31,64.01 35.31,67.41 POT_LINB.1
  Bottom 0.305: JP3.7 4.57,64.77 5.33,64.01 v35.31,64.01
POT_LINB_3  (via drill 0.35)  (2 unrouted)
  Top 0.305: v40.39,62.23 40.39,67.33 POT_LINB.3
  Bottom 0.305: JP3.6 v40.39,62.23
UNIPOLAR_A  (via drill 0.35)  (2 unrouted)
  Top 0.305: v19.81,58.93 19.81,43.18 17.02,40.39 17.02,37.82 S1.3
  Bottom 0.305: JP9.3 47.46,55.92 44.45,58.93 v19.81,58.93
UNIPOLAR_B  (via drill 0.35)  (2 unrouted)
  Top 0.305: S2.3 33.12,45.11 30.73,47.5 v30.73,52.32
  Bottom 0.305: JP9.1 44.7,49.53 41.91,52.32 v30.73,52.32
(copper drawn outside any net)
  shapes: Top area x2